# EAGLE design schematic (EAGLE 9.5.1)

## Sheet 1 of 3
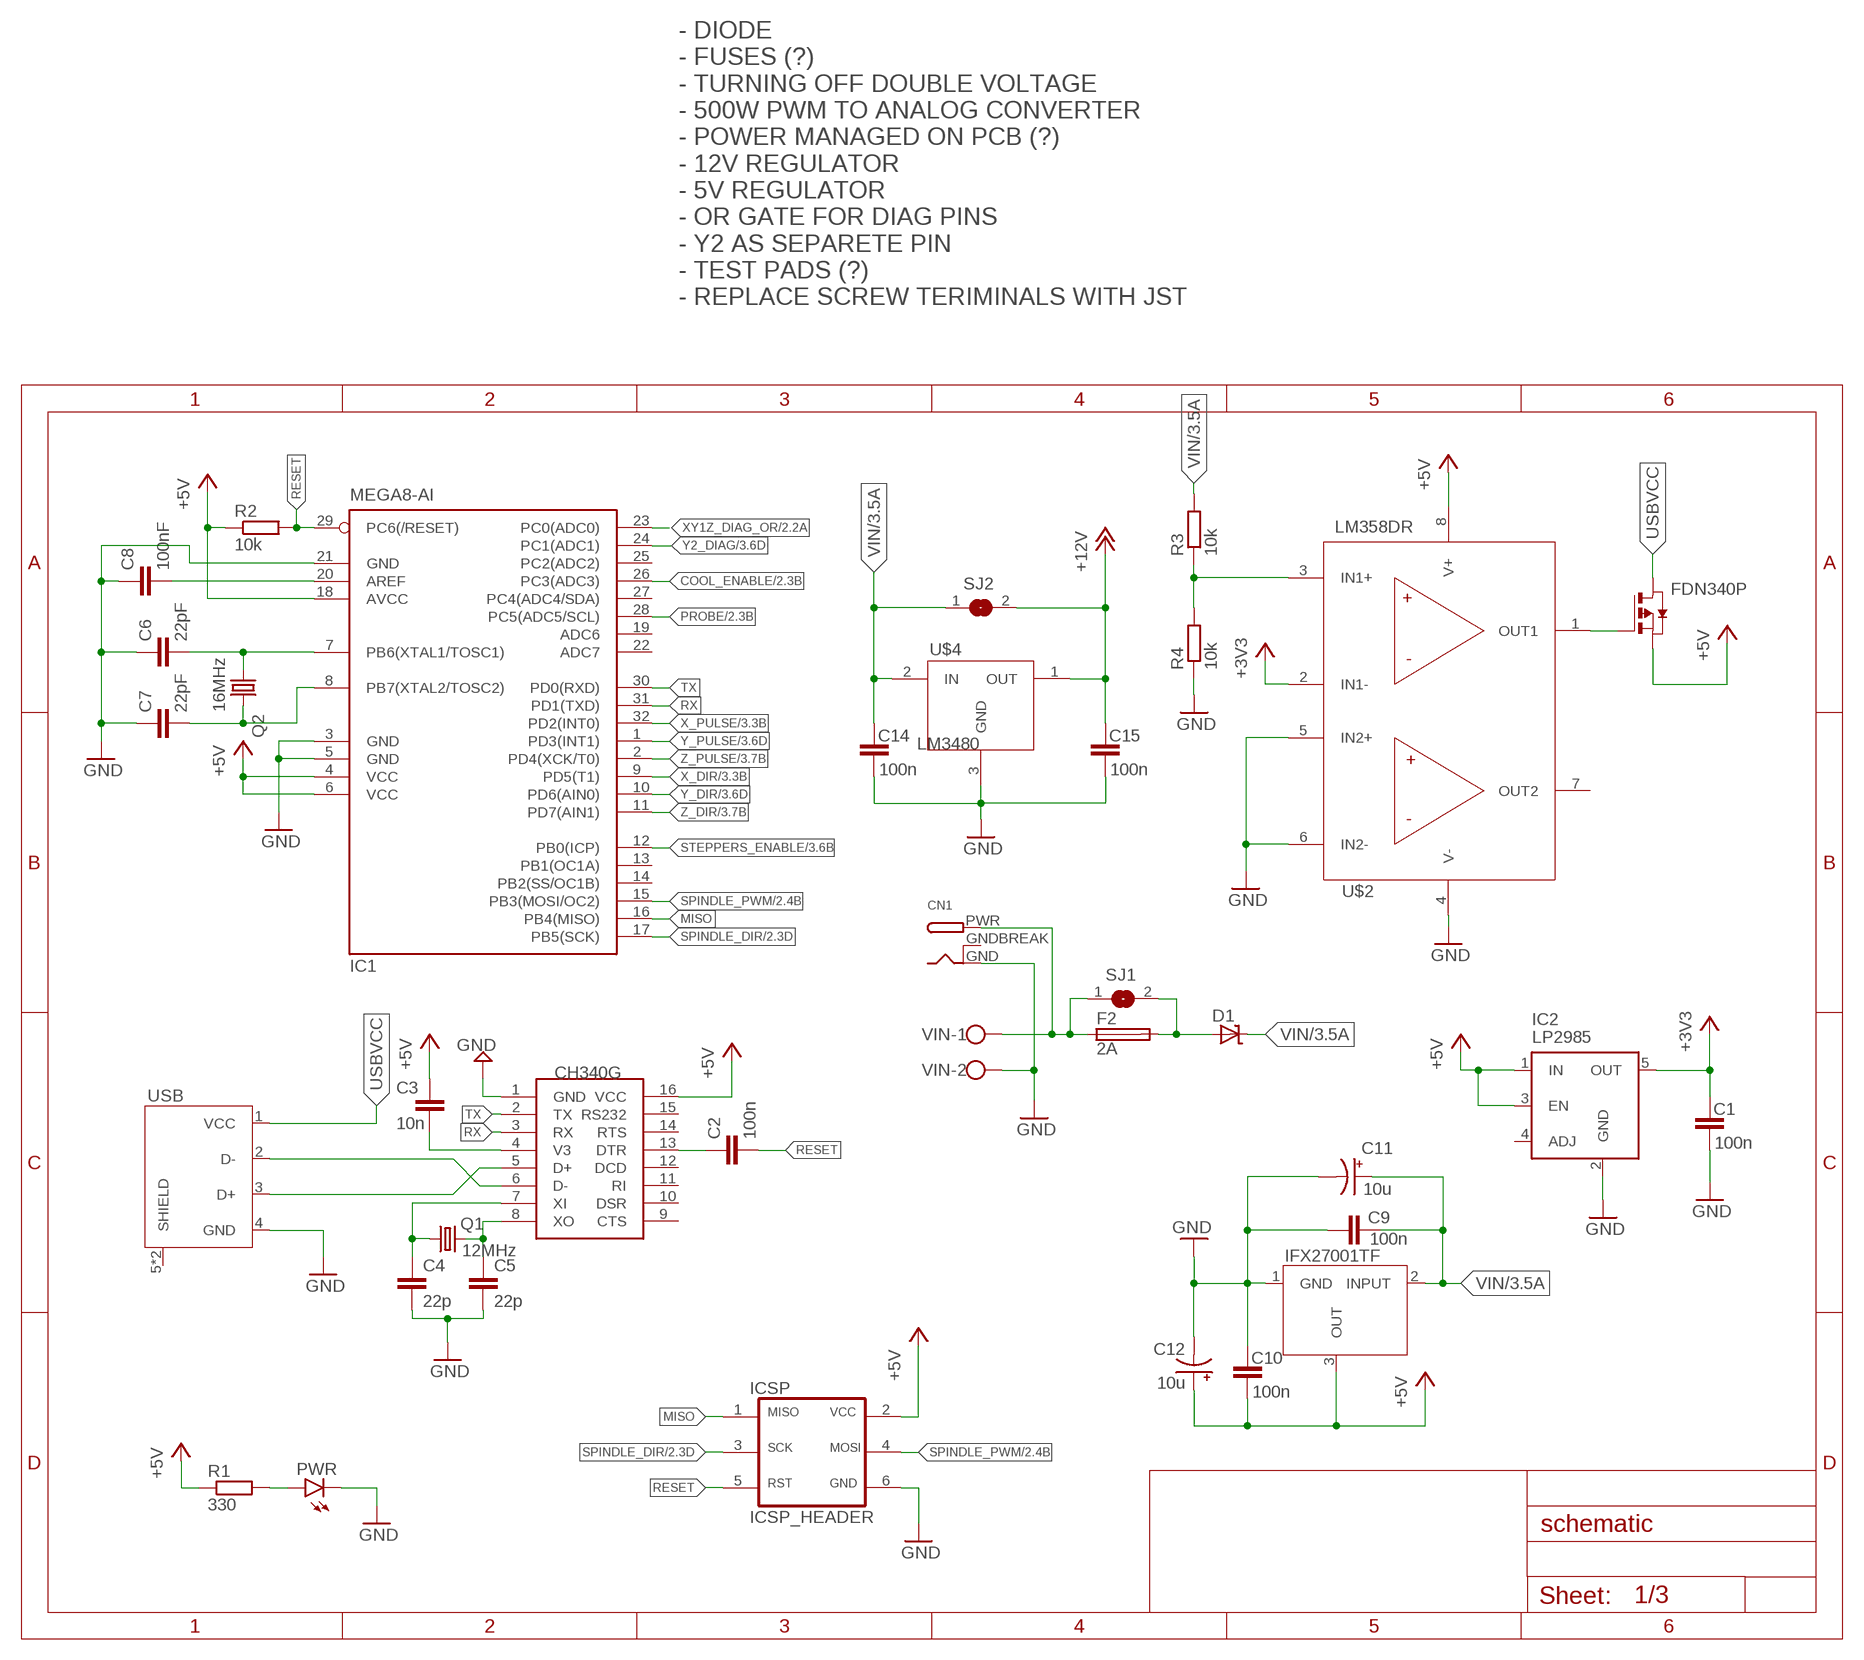
[diagram p0: schematic, sheet 1]

### Parts
C1  100n  C-EUC0603  [C0603]
C2  100n  C-EUC0603  [C0603]
C3  10n  C-EUC0603  [C0603]
C4  22p  C-EUC0603  [C0603]
C5  22p  C-EUC0603  [C0603]
C6  22pF  C-EUC0603  [C0603]
C7  22pF  C-EUC0603  [C0603]
C8  100nF  C-EUC0603  [C0603]
C9  100n  C-EUC0603  [C0603]
C10  100n  C-EUC0603  [C0603]
C11  10u  CPOL-USE5-5  [E5-5]
C12  10u  CPOL-USE5-5  [E5-5]
C14  100n  C-EUC0603  [C0603]
C15  100n  C-EUC0603  [C0603]
CN1  DCBARRELPTH  [DCJACK_2MM_PTH]
D1  SD-SMA  [SMA]
F2  2A  GSH15  [GSH15]
FDN340P  FDN340PSOT23  [SOT95P240X110-3N]
IC1  MEGA8-AI  [TQFP32-08]
IC2  LP2985  MIC5219BM5  [SOT23-5]
IFX27001TF  IFX27001TFV50TO252  [TO228P998X230-3N]
PWR  LEDCHIPLED_0805  [CHIPLED_0805]
Q1  12MHz  KX-9B  [5.0X3.2_2]
Q2  16MHz  KX-9B  [5.0X3.2_2]
R1  330  R-EU_R0603  [R0603]
R2  10k  R-EU_R0603  [R0603]
R3  10k  R-EU_R0603  [R0603]
R4  10k  R-EU_R0603  [R0603]
SJ1  SJW  [SJW]
SJ2  SJ  [SJ]
U$1  CH340G  [SOIC16]
U$2  LM358  LM358DRLM358DR_SOIC8  [SOIC127P599X175-8N]
U$4  LM3480  LM3480IM3SOT23-3  [SOT95P247X112-3N]
U$6  ICSP_HEADER  [ICSP_HEADER]
USB  U-USBBR04P-F000  [U-USBBR04P-F000]
VIN  W237-102  [W237-102]

### Nets
+3V3: C1.2 IC2.5(OUT) U$2.2(IN1-)
+5V: C3.1 C10.1 C12.+ FDN340P.2(S) IC1.4(VCC) IC1.6(VCC) IC1.18(AVCC) IC2.1(IN) IC2.3(EN) IFX27001TF.3(OUT) R1.1 R2.1 U$1.16(VCC) U$2.8(V+) U$6.2(VCC) ; also sheet 2,3
+12V: C15.2 SJ2.2 U$4.1(OUT) ; also sheet 2
COOL_ENABLE: IC1.26(PC3(ADC3)) ; also sheet 2
GND: C1.1 C4.2 C5.2 C6.1 C7.1 C8.1 C9.1 C10.2 C11.- C12.- C14.1 C15.1 CN1.GND IC1.3(GND) IC1.5(GND) IC1.21(GND) IC2.2(GND) IFX27001TF.1(GND) PWR.C R4.1 U$1.1(GND) U$2.4(V-) U$2.5(IN2+) U$2.6(IN2-) U$4.3(GND) U$6.6(GND) USB.4(GND) VIN.2 ; also sheet 2,3
MISO: IC1.16(PB4(MISO)) U$6.1(MISO)
N$1: C3.2 U$1.4(V3)
N$2: C2.1 U$1.13(DTR)
N$3: C5.1 Q1.2 U$1.8(XO)
N$4: C4.1 Q1.1 U$1.7(XI)
N$5: U$1.6(D-) USB.2(D-)
N$6: PWR.A R1.2
N$7: C6.2 IC1.7(PB6(XTAL1/TOSC1)) Q2.1
N$8: C7.2 IC1.8(PB7(XTAL2/TOSC2)) Q2.2
N$9: C8.2 IC1.20(AREF)
N$11: U$1.5(D+) USB.3(D+)
N$12: FDN340P.1(G) U$2.1(OUT1)
N$15: CN1.PWR F2.1 SJ1.1 VIN.1
N$16: R3.1 R4.2 U$2.3(IN1+)
N$17: D1.A F2.2 SJ1.2
PROBE: IC1.28(PC5(ADC5/SCL)) ; also sheet 2
RESET: C2.2 IC1.29(PC6(/RESET)) R2.2 U$6.5(RST)
RX: IC1.31(PD1(TXD)) U$1.3(RX)
SPINDLE_DIR: IC1.17(PB5(SCK)) U$6.3(SCK) ; also sheet 2
SPINDLE_PWM: IC1.15(PB3(MOSI/OC2)) U$6.4(MOSI) ; also sheet 2
STEPPERS_ENABLE: IC1.12(PB0(ICP)) ; also sheet 3
TX: IC1.30(PD0(RXD)) U$1.2(TX)
USBVCC: FDN340P.3(D) USB.1(VCC)
VIN: C9.2 C11.+ C14.2 D1.C IFX27001TF.2(INPUT) R3.2 SJ2.1 U$4.2(IN) ; also sheet 3
X_DIR: IC1.9(PD5(T1)) ; also sheet 3
X_PULSE: IC1.32(PD2(INT0)) ; also sheet 3
XY1Z_DIAG_OR: IC1.23(PC0(ADC0)) ; also sheet 2
Y2_DIAG: IC1.24(PC1(ADC1)) ; also sheet 3
Y_DIR: IC1.10(PD6(AIN0)) ; also sheet 3
Y_PULSE: IC1.1(PD3(INT1)) ; also sheet 3
Z_DIR: IC1.11(PD7(AIN1)) ; also sheet 3
Z_PULSE: IC1.2(PD4(XCK/T0)) ; also sheet 3
Unconnected: IC1.13(PB1(OC1A)) IC1.14(PB2(SS/OC1B)) IC1.19(ADC6) IC1.22(ADC7) IC1.25(PC2(ADC2)) IC1.27(PC4(ADC4/SDA)) IC2.4(ADJ) U$1.9(CTS) U$1.10(DSR) U$1.11(RI) U$1.12(DCD) U$1.14(RTS) U$1.15(RS232) U$2.7(OUT2) USB.5(SHIELD) USB.6(SHIELD)

### Notes on the sheet
- - DIODE
  - FUSES (?)
  - TURNING OFF DOUBLE VOLTAGE
  - 500W PWM TO ANALOG CONVERTER
  - POWER MANAGED ON PCB (?)
  - 12V REGULATOR
  - 5V REGULATOR
  - OR GATE FOR DIAG PINS
  - Y2 AS SEPARETE PIN
  - TEST PADS (?)
  - REPLACE SCREW TERIMINALS WITH JST

## Sheet 2 of 3
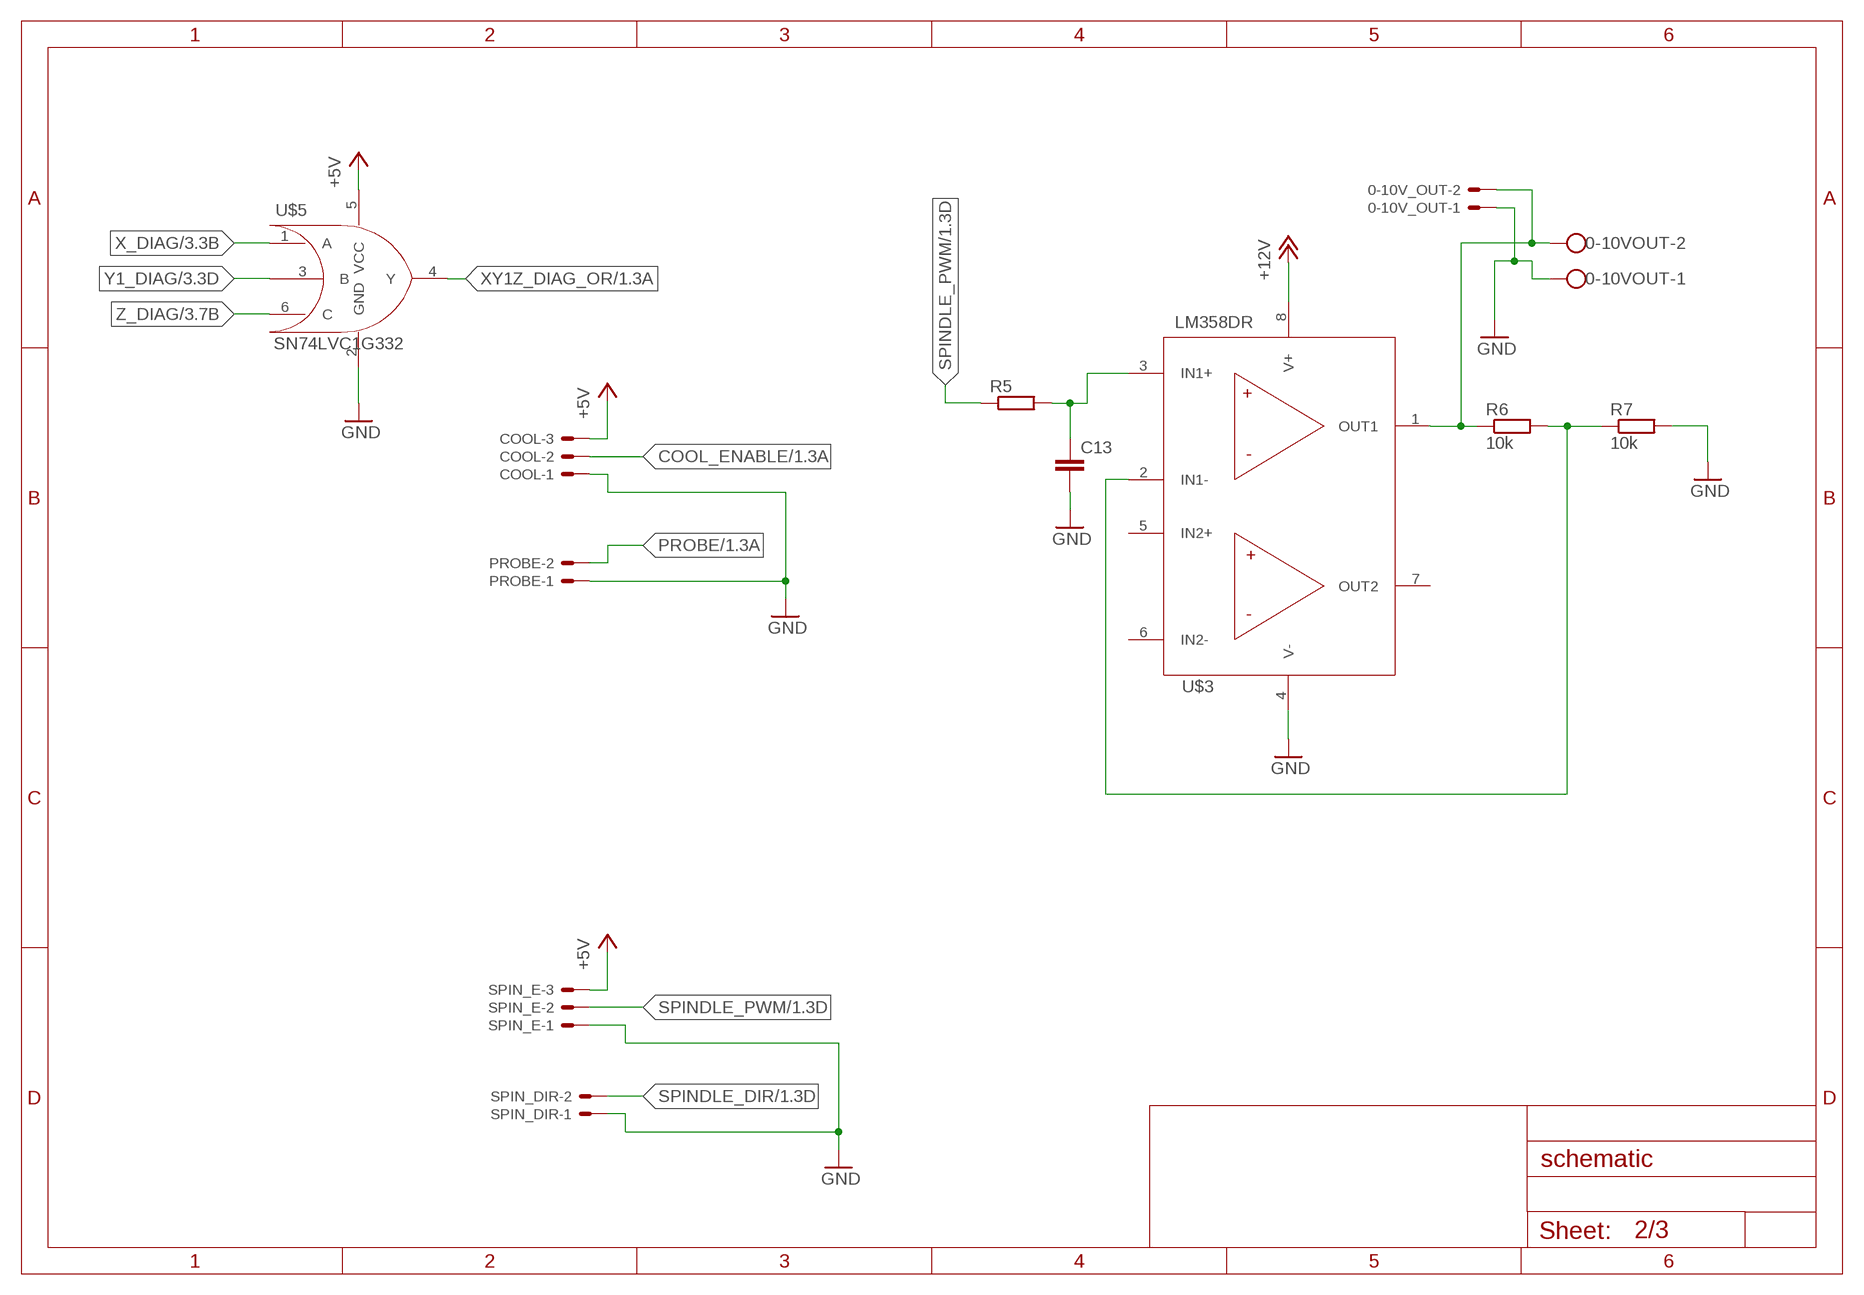
[diagram p1: schematic, sheet 2]

### Parts
0-10V_OUT  JST-XH-02-PIN-LONG-PAD  [JST-XH-02-PACKAGE-LONG-PAD]
0-10VOUT  W237-102  [W237-102]
C13  C-EUC0603  [C0603]
COOL  JST-XH-03-PIN-LONG-PAD  [JST-XH-03-PACKAGE-LONG-PAD]
PROBE  JST-XH-02-PIN-LONG-PAD  [JST-XH-02-PACKAGE-LONG-PAD]
R5  R-EU_R0603  [R0603]
R6  10k  R-EU_R0603  [R0603]
R7  10k  R-EU_R0603  [R0603]
SPIN_DIR  JST-XH-02-PIN-LONG-PAD  [JST-XH-02-PACKAGE-LONG-PAD]
SPIN_E  JST-XH-03-PIN-LONG-PAD  [JST-XH-03-PACKAGE-LONG-PAD]
U$3  LM358  LM358DRLM358DR_SOIC8  [SOIC127P599X175-8N]
U$5  SN74LVC1G332  SN74LVC1G332SOT23_SN74LVC1G332  [SOT95P280X110-6N]

### Nets
+5V: COOL.3 SPIN_E.3 U$5.5(VCC) ; also sheet 1,3
+12V: U$3.8(V+) ; also sheet 1
COOL_ENABLE: COOL.2 ; also sheet 1
GND: 0-10V_OUT.1 0-10VOUT.1 C13.2 COOL.1 PROBE.1 R7.2 SPIN_DIR.1 SPIN_E.1 U$3.4(V-) U$5.2(GND) ; also sheet 1,3
N$19: C13.1 R5.2 U$3.3(IN1+)
N$20: R6.2 R7.1 U$3.2(IN1-)
N$21: 0-10V_OUT.2 0-10VOUT.2 R6.1 U$3.1(OUT1)
PROBE: PROBE.2 ; also sheet 1
SPINDLE_DIR: SPIN_DIR.2 ; also sheet 1
SPINDLE_PWM: R5.1 SPIN_E.2 ; also sheet 1
X_DIAG: U$5.1(A) ; also sheet 3
XY1Z_DIAG_OR: U$5.4(Y) ; also sheet 1
Y1_DIAG: U$5.3(B) ; also sheet 3
Z_DIAG: U$5.6(C) ; also sheet 3
Unconnected: U$3.5(IN2+) U$3.6(IN2-) U$3.7(OUT2)

## Sheet 3 of 3
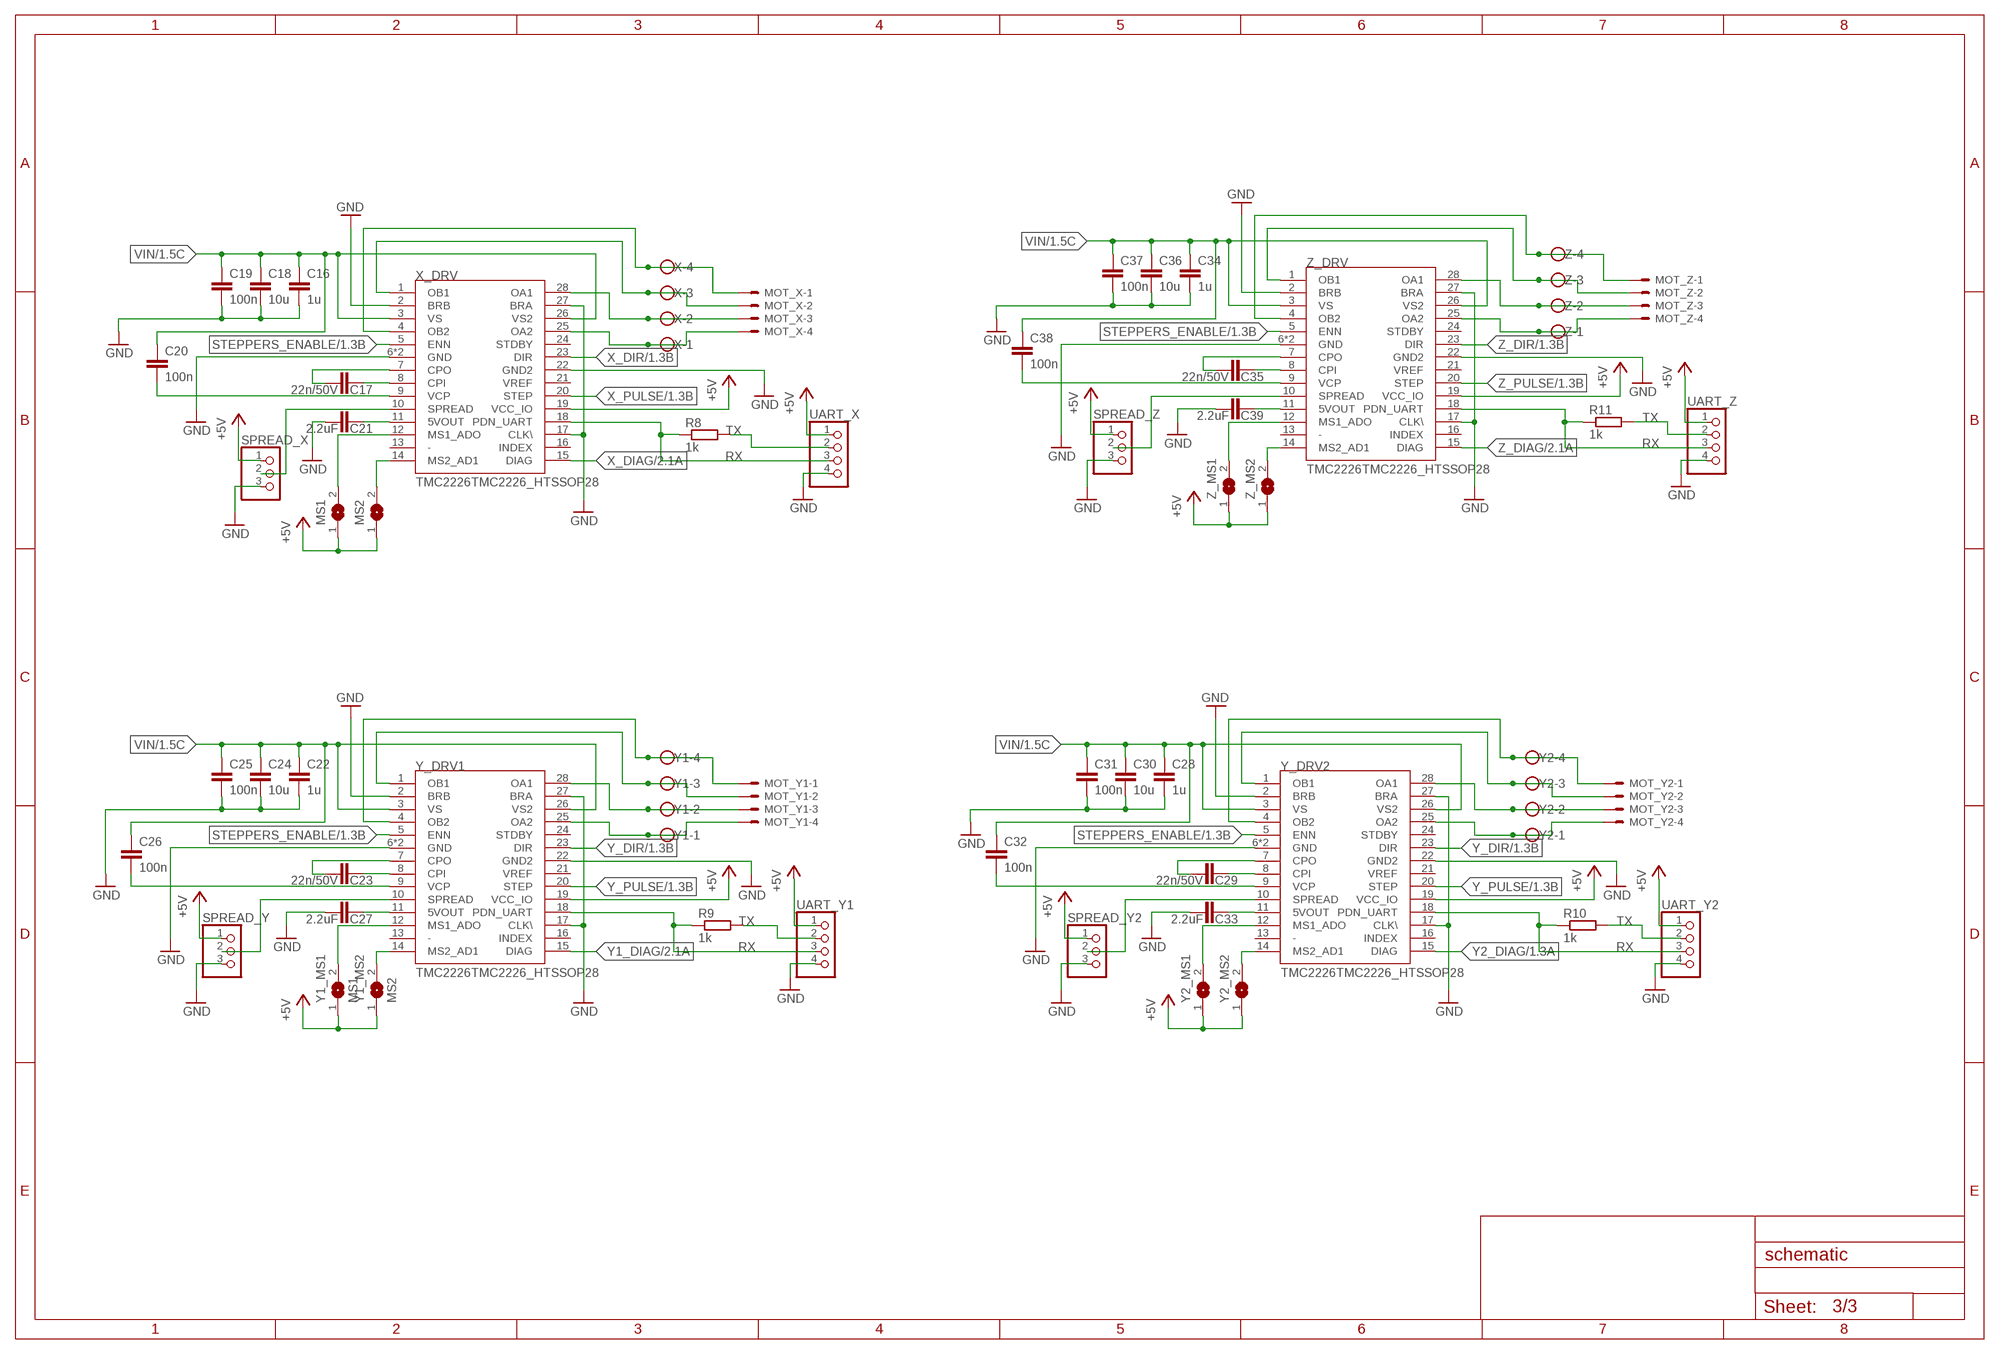
[diagram p2: schematic, sheet 3]

### Parts
C16  1u  C-EUC0603  [C0603]
C17  22n/50V  C-EUC0603  [C0603]
C18  10u  C-EUC0603  [C0603]
C19  100n  C-EUC0603  [C0603]
C20  100n  C-EUC0603  [C0603]
C21  2.2uF  C-EUC0603  [C0603]
C22  1u  C-EUC0603  [C0603]
C23  22n/50V  C-EUC0603  [C0603]
C24  10u  C-EUC0603  [C0603]
C25  100n  C-EUC0603  [C0603]
C26  100n  C-EUC0603  [C0603]
C27  2.2uF  C-EUC0603  [C0603]
C28  1u  C-EUC0603  [C0603]
C29  22n/50V  C-EUC0603  [C0603]
C30  10u  C-EUC0603  [C0603]
C31  100n  C-EUC0603  [C0603]
C32  100n  C-EUC0603  [C0603]
C33  2.2uF  C-EUC0603  [C0603]
C34  1u  C-EUC0603  [C0603]
C35  22n/50V  C-EUC0603  [C0603]
C36  10u  C-EUC0603  [C0603]
C37  100n  C-EUC0603  [C0603]
C38  100n  C-EUC0603  [C0603]
C39  2.2uF  C-EUC0603  [C0603]
MOT_X  JST-XH-04-PIN-LONG-PAD  [JST-XH-04-PACKAGE-LONG-PAD]
MOT_Y1  JST-XH-04-PIN-LONG-PAD  [JST-XH-04-PACKAGE-LONG-PAD]
MOT_Y2  JST-XH-04-PIN-LONG-PAD  [JST-XH-04-PACKAGE-LONG-PAD]
MOT_Z  JST-XH-04-PIN-LONG-PAD  [JST-XH-04-PACKAGE-LONG-PAD]
MS1  SJ  [SJ]
MS2  SJ  [SJ]
R8  1k  R-EU_R0603  [R0603]
R9  1k  R-EU_R0603  [R0603]
R10  1k  R-EU_R0603  [R0603]
R11  1k  R-EU_R0603  [R0603]
SPREAD_X  PINHD-1X3  [1X03]
SPREAD_Y  PINHD-1X3  [1X03]
SPREAD_Y2  PINHD-1X3  [1X03]
SPREAD_Z  PINHD-1X3  [1X03]
UART_X  PINHD-1X4  [1X04]
UART_Y1  PINHD-1X4  [1X04]
UART_Y2  PINHD-1X4  [1X04]
UART_Z  PINHD-1X4  [1X04]
X  W237-4  [W237-4]
X_DRV  TMC2226TMC2226_HTSSOP28  [SOP65P640X120-29T275X620N]
Y1  W237-4  [W237-4]
Y1_MS1  MS1  SJ  [SJ]
Y1_MS2  MS2  SJ  [SJ]
Y2  W237-4  [W237-4]
Y2_MS1  SJ  [SJ]
Y2_MS2  SJ  [SJ]
Y_DRV1  TMC2226TMC2226_HTSSOP28  [SOP65P640X120-29T275X620N]
Y_DRV2  TMC2226TMC2226_HTSSOP28  [SOP65P640X120-29T275X620N]
Z  W237-4  [W237-4]
Z_DRV  TMC2226TMC2226_HTSSOP28  [SOP65P640X120-29T275X620N]
Z_MS1  SJ  [SJ]
Z_MS2  SJ  [SJ]

### Nets
+5V: MS1.1 MS2.1 SPREAD_X.1 SPREAD_Y2.1 SPREAD_Y.1 SPREAD_Z.1 UART_X.1 UART_Y1.1 UART_Y2.1 UART_Z.1 X_DRV.19(VCC_IO) Y1_MS1.1 Y1_MS2.1 Y2_MS1.1 Y2_MS2.1 Y_DRV1.19(VCC_IO) Y_DRV2.19(VCC_IO) Z_DRV.19(VCC_IO) Z_MS1.1 Z_MS2.1 ; also sheet 1,2
GND: C16.2 C18.2 C19.2 C21.1 C22.2 C24.2 C25.2 C27.1 C28.2 C30.2 C31.2 C33.1 C34.2 C36.2 C37.2 C39.1 SPREAD_X.3 SPREAD_Y2.3 SPREAD_Y.3 SPREAD_Z.3 UART_X.4 UART_Y1.4 UART_Y2.4 UART_Z.4 X_DRV.2(BRB) X_DRV.6(GND) X_DRV.17(CLK\) X_DRV.22(GND2) X_DRV.27(BRA) X_DRV.29(GND) Y_DRV1.2(BRB) Y_DRV1.6(GND) Y_DRV1.17(CLK\) Y_DRV1.22(GND2) Y_DRV1.27(BRA) Y_DRV1.29(GND) Y_DRV2.2(BRB) Y_DRV2.6(GND) Y_DRV2.17(CLK\) Y_DRV2.22(GND2) Y_DRV2.27(BRA) Y_DRV2.29(GND) Z_DRV.2(BRB) Z_DRV.6(GND) Z_DRV.17(CLK\) Z_DRV.22(GND2) Z_DRV.27(BRA) Z_DRV.29(GND) ; also sheet 1,2
N$18: C17.2 X_DRV.8(CPI)
N$22: C17.1 X_DRV.7(CPO)
N$23: MOT_X.1 X.4 X_DRV.4(OB2)
N$24: MOT_X.2 X.3 X_DRV.1(OB1)
N$25: MOT_X.3 X.2 X_DRV.28(OA1)
N$26: MOT_X.4 X.1 X_DRV.25(OA2)
N$27: SPREAD_X.2 X_DRV.10(SPREAD)
N$28: C20.2 X_DRV.9(VCP)
N$29: C21.2 X_DRV.11(5VOUT)
N$30: R8.1 UART_X.3 X_DRV.18(PDN_UART)
N$31: MS1.2 X_DRV.12(MS1_ADO)
N$32: MS2.2 X_DRV.14(MS2_AD1)
N$33: R8.2 UART_X.2
N$34: C23.2 Y_DRV1.8(CPI)
N$35: C23.1 Y_DRV1.7(CPO)
N$36: MOT_Y1.1 Y1.4 Y_DRV1.4(OB2)
N$37: MOT_Y1.2 Y1.3 Y_DRV1.1(OB1)
N$38: MOT_Y1.3 Y1.2 Y_DRV1.28(OA1)
N$39: MOT_Y1.4 Y1.1 Y_DRV1.25(OA2)
N$40: C26.2 Y_DRV1.9(VCP)
N$41: SPREAD_Y.2 Y_DRV1.10(SPREAD)
N$42: C27.2 Y_DRV1.11(5VOUT)
N$43: Y1_MS1.2 Y_DRV1.12(MS1_ADO)
N$44: Y1_MS2.2 Y_DRV1.14(MS2_AD1)
N$45: R9.1 UART_Y1.3 Y_DRV1.18(PDN_UART)
N$46: R9.2 UART_Y1.2
N$47: C29.2 Y_DRV2.8(CPI)
N$48: C29.1 Y_DRV2.7(CPO)
N$49: MOT_Y2.1 Y2.4 Y_DRV2.4(OB2)
N$50: MOT_Y2.2 Y2.3 Y_DRV2.1(OB1)
N$51: MOT_Y2.3 Y2.2 Y_DRV2.28(OA1)
N$52: MOT_Y2.4 Y2.1 Y_DRV2.25(OA2)
N$53: C32.2 Y_DRV2.9(VCP)
N$54: SPREAD_Y2.2 Y_DRV2.10(SPREAD)
N$55: C33.2 Y_DRV2.11(5VOUT)
N$56: Y2_MS1.2 Y_DRV2.12(MS1_ADO)
N$57: Y2_MS2.2 Y_DRV2.14(MS2_AD1)
N$58: R10.1 UART_Y2.3 Y_DRV2.18(PDN_UART)
N$59: R10.2 UART_Y2.2
N$60: C35.2 Z_DRV.8(CPI)
N$61: C35.1 Z_DRV.7(CPO)
N$62: MOT_Z.1 Z.4 Z_DRV.4(OB2)
N$63: MOT_Z.2 Z.3 Z_DRV.1(OB1)
N$64: MOT_Z.3 Z.2 Z_DRV.28(OA1)
N$65: MOT_Z.4 Z.1 Z_DRV.25(OA2)
N$66: C38.2 Z_DRV.9(VCP)
N$67: SPREAD_Z.2 Z_DRV.10(SPREAD)
N$68: C39.2 Z_DRV.11(5VOUT)
N$69: Z_DRV.12(MS1_ADO) Z_MS1.2
N$70: Z_DRV.14(MS2_AD1) Z_MS2.2
N$71: R11.1 UART_Z.3 Z_DRV.18(PDN_UART)
N$72: R11.2 UART_Z.2
STEPPERS_ENABLE: X_DRV.5(ENN) Y_DRV1.5(ENN) Y_DRV2.5(ENN) Z_DRV.5(ENN) ; also sheet 1
VIN: C16.1 C18.1 C19.1 C20.1 C22.1 C24.1 C25.1 C26.1 C28.1 C30.1 C31.1 C32.1 C34.1 C36.1 C37.1 C38.1 X_DRV.3(VS) X_DRV.26(VS2) Y_DRV1.3(VS) Y_DRV1.26(VS2) Y_DRV2.3(VS) Y_DRV2.26(VS2) Z_DRV.3(VS) Z_DRV.26(VS2) ; also sheet 1
X_DIAG: X_DRV.15(DIAG) ; also sheet 2
X_DIR: X_DRV.23(DIR) ; also sheet 1
X_PULSE: X_DRV.20(STEP) ; also sheet 1
Y1_DIAG: Y_DRV1.15(DIAG) ; also sheet 2
Y2_DIAG: Y_DRV2.15(DIAG) ; also sheet 1
Y_DIR: Y_DRV1.23(DIR) Y_DRV2.23(DIR) ; also sheet 1
Y_PULSE: Y_DRV1.20(STEP) Y_DRV2.20(STEP) ; also sheet 1
Z_DIAG: Z_DRV.15(DIAG) ; also sheet 2
Z_DIR: Z_DRV.23(DIR) ; also sheet 1
Z_PULSE: Z_DRV.20(STEP) ; also sheet 1
Unconnected: X_DRV.13(-) X_DRV.16(INDEX) X_DRV.21(VREF) X_DRV.24(STDBY) Y_DRV1.13(-) Y_DRV1.16(INDEX) Y_DRV1.21(VREF) Y_DRV1.24(STDBY) Y_DRV2.13(-) Y_DRV2.16(INDEX) Y_DRV2.21(VREF) Y_DRV2.24(STDBY) Z_DRV.13(-) Z_DRV.16(INDEX) Z_DRV.21(VREF) Z_DRV.24(STDBY)

### Notes on the sheet
- TX
- TX
- RX
- RX
- TX | TX
- RX | RX

## Power pins joined to a net without a drawn wire
GNDBREAK: CN1.GNDBREAK

## Library data of the parts
0-10V_OUT PROBE SPIN_DIR = Rembrandt Electronics - JST XH Connectors v1-0:JST-XH-02-PIN: JST XH Connector 2 Pin Wire to board connector. Pitch: 2,54 mm, (0.100") Number of pins: 2 Created by Rembrandt Electronics www.rembrandtelectronics.com
0-10VOUT VIN = con-wago-500:W237-102: WAGO SCREW CLAMP; MPN: 237-102; OC_FARNELL: unknown; OC_NEWARK: 70K9898
C1-C10 C13-C39 = rcl:C-EU: CAPACITOR, European symbol; SPICEPREFIX: C
C11 C12 = rcl:CPOL-US: POLARIZED CAPACITOR, American symbol; SPICEPREFIX: C
CN1 = adafruit:DCBARREL: 2.0mm DC Barrel Jack DCJACK_2MM_PTH - Through Hole Jack (4UConnector: 05537)
COOL SPIN_E = Rembrandt Electronics - JST XH Connectors v1-0:JST-XH-03-PIN: JST XH Connector 2 Pin Wire to board connector. Pitch: 2,54 mm, (0.100") Number of pins: 3 Created by Rembrandt Electronics www.rembrandtelectronics.com
D1 = diodes:SD-: Schottky diode
F2 = fuse:GSH15: FUSE HOLDER grid 15mm, 19649 Wickmann; MPN: 64900001039; OC_FARNELL: 1271673; OC_NEWARK: 02P0318
FDN340P = NikodemBartnik:FDN340P
IC1 = atmel:MEGA8: MICROCONTROLLER 8 Kbytes FLASH, 1 kbytes SRAM, 512 bytes EEPROM, USART, 6-channel 10 bit ADC, 2-channel 8 bit ADC Pin compatible with Atmega48, ATMega88, ATMega168 Source: avr.lbr; MPN: ATMEGA8-16AU; OC_FARNELL: 9171371; OC_NEWARK: 73M8863
IC2 = v-reg-micrel:MIC5219BM5: VOLTAGE REGULATOR; MF: ALTERA CORPORATION; MPN: MIC5219BM5 TR; OC_FARNELL: 1100656; OC_NEWARK: 09J8939
IFX27001TF = NikodemBartnik:IFX27001TFV50
MOT_X MOT_Y1 MOT_Y2 MOT_Z = Rembrandt Electronics - JST XH Connectors v1-0:JST-XH-04-PIN: JST XH Connector 2 Pin Wire to board connector. Pitch: 2,54 mm, (0.100") Number of pins: 4 Created by Rembrandt Electronics www.rembrandtelectronics.com
MS1 MS2 SJ1 SJ2 Y1_MS1 Y1_MS2 Y2_MS1 Y2_MS2 Z_MS1 Z_MS2 = jumper:SJ: SMD solder JUMPER
PWR = led:LED: LED OSRAM: - CHIPLED LG R971, LG N971, LY N971, LG Q971, LY Q971, LO R971, LY R971 LH N974, LH R974 LS Q976, LO Q976, LY Q976 LO Q996 - Hyper CHIPLED LW Q18S LB Q993, LB Q99A, LB R99A - SideLED LS A670, LO A670, LY A670, LG A670, LP A670 LB A673, LV A673, LT A673, LW A673 LH A674 LY A675 LS A676, LA A676, LO A676, LY A676, LW A676 LS A679, LY A679, LG A679 - Hyper Micro SIDELED® LS Y876, LA Y876, LO Y876, LY Y876 LT Y87S - SmartLED LW L88C, LW L88S LB L89C, LB L89S, LG L890 LS L89K, LO L89K, LY L89K LS L896, LA L896, LO L896, LY L896 - TOPLED LS T670, LO T670, LY T670, LG T670, LP T670 LSG T670, LSP T670, LSY T670, LOP T670, LYG T670 LG T671, LOG T671, LSG T671 LB T673, LV T673, LT T673, LW T673 LH T674 LS T676, LA T676, LO T676, LY T676, LB T676, LH T676, LSB T676, LW T676 LB T67C, LV T67C, LT T67C, LS T67K, LO T67K, LY T67K, LW E67C LS E67B, LA E67B, LO E67B, LY E67B, LB E67C, LV E67C, LT E67C LW T67C LS T679, LY T679, LG T679 LS T770, LO T770, LY T770, LG T770, LP T770 LB T773, LV T773, LT T773, LW T773 LH T774 LS E675, LA E675, LY E675, LS T675 LS T776, LA T776, LO T776, LY T776, LB T776 LHGB T686 LT T68C, LB T68C - Hyper Mini TOPLED® LB M676 - Mini TOPLED Santana® LG M470 LS M47K, LO M47K, LY M47K Source: http://www.osram.convergy.de LUXEON: - LUMILED® LXK2-PW12-R00, LXK2-PW12-S00, LXK2-PW14-U00, LXK2-PW14-V00 LXK2-PM12-R00, LXK2-PM12-S00, LXK2-PM14-U00 LXK2-PE12-Q00, LXK2-PE12-R00, LXK2-PE12-S00, LXK2-PE14-T00, LXK2-PE14-U00 LXK2-PB12-K00, LXK2-PB12-L00, LXK2-PB12-M00, LXK2-PB14-N00, LXK2-PB14-P00, LXK2-PB14-Q00 LXK2-PR12-L00, LXK2-PR12-M00, LXK2-PR14-Q00, LXK2-PR14-R00 LXK2-PD12-Q00, LXK2-PD12-R00, LXK2-PD12-S00 LXK2-PH12-R00, LXK2-PH12-S00 LXK2-PL12-P00, LXK2-PL12-Q00, LXK2-PL12-R00 Source: www.luxeon.com KINGBRIGHT: KA-3528ASYC Source: www.kingbright.com
Q1 Q2 = crystal-geyer_V1_0:KX: Quartz Crystals (MHz) SMD: KX - Serie Model Size l/w/h [mm] Frequency Range Frequency Stability Temp. Range [°C] Load Capacitance AECQ 200 availabel Datasheet KX-4 KX-5 KX-6 KX-7 KX-9A KX-9B KX-12A KX-12B KX-13 KX-20 KX-K KX-KS 1.6/1.2/0.3 2.0/1.6/0.45 2.5/2.0/0.55 3.2/2.5/0.8 5.0/3.2/1.0 5.0/3.2/1.1 6.0/3.5/1.1 6.0/3.5/1.0 7.0/5.0 /1.3 11.6/5.5/1.6 12.3/4.5/4.2 12.3/4.5/3.2 24.0 ~ 80.0 MHz 16.0 ~ 80.0 MHz 12.0 ~ 80.0 MHz 8.0 ~ 60.0 MHz 7,68 ~ 300,0 MHz 8,0 ~ 50,0 MHz 8,0 ~ 150,0 MHz 8,0 ~ 50,0 MHz 6,0 ~ 160,0 MHz 3,579 ~ 25,0 MHz 3,579 ~ 70,0 MHz 3,579 ~ 70,0 MHz ±10 … ±50ppm ±10 … ±50ppm ±10 … ±50ppm ±10 … ±50ppm ±10 … ±50ppm ±10 … ±50ppm ±10 … ±50ppm ±10 … ±50ppm ±10 … ±50ppm ±50ppm ±10 … ±50ppm ±10 … ±50ppm (*) -40°C …+85°C (*) -40°C …+125°C (*) -40°C …+125°C (*) -40°C …+125°C (*) -40°C …+105°C (*) -40°C …+105°C (*) -40°C …+125°C (*) -40°C …+105°C (*) -40°C …+105°C (*) -40°C …+105°C (*) -40°C …+85°C (*) -40°C …+85°C 8, 8…16 8, 8…16 10, 8…16 12, 7…20 16, 10…20 16, 10…20 16, 10…20 16, 12…20 16, 12…20 16, 12…20 16, 12…30 16, 12…30 - yes yes yes - - - - - - - - KX-4.pdf <http://www.geyer-electronic.de/uploads/tx_userartikelfrequenz/GEYER-KX-4.pdf> KX-5.pdf <http://www.geyer-electronic.de/uploads/tx_userartikelfrequenz/GEYER-KX-5.pdf> KX-6.pdf <http://www.geyer-electronic.de/uploads/tx_userartikelfrequenz/GEYER-KX-6.pdf> KX-7.pdf <http://www.geyer-electronic.de/uploads/tx_userartikelfrequenz/GEYER-KX-7.pdf> KX-9A.pdf <http://www.geyer-electronic.de/uploads/tx_userartikelfrequenz/GEYER-KX-9A.pdf> KX-9B.pdf <http://www.geyer-electronic.de/uploads/tx_userartikelfrequenz/GEYER-KX-9B.pdf> KX-12A.pdf <http://www.geyer-electronic.de/uploads/tx_userartikelfrequenz/GEYER-KX-12A.pdf> KX-12B.pdf <http://www.geyer-electronic.de/uploads/tx_userartikelfrequenz/GEYER-KX-12B.pdf> KX-13.pdf <http://www.geyer-electronic.de/uploads/tx_userartikelfrequenz/GEYER-KX-13.pdf> KX-20.pdf <http://www.geyer-electronic.de/uploads/tx_userartikelfrequenz/GEYER-KX-20.pdf> KX-K.pdf <http://www.geyer-electronic.de/uploads/tx_userartikelfrequenz/GEYER-KX-K.pdf> KX-KS.pdf <http://www.geyer-electronic.de/uploads/tx_userartikelfrequenz/GEYER-KX-KS.pdf> <http://www.geyer-electronic.de/fileadmin/template/img/logo-geyer-electronic.png> Details see: http://www.geyer-electronic.de/Frequenz-Produkte.9.0.html Created 2016-06-07, Hans Locher 2016 (C) Geyer Quartz Technology KX4,KX5,KX6,KX7,KX9A,KX9B,KX12A,KX12B,KX13,KX20,KXK,KXKS;1612;2016;2520;3225;5032;6035;7050;11655;12345;1,6x1,2;2,0x1,6;2,5x2,0;3,2x2,5;5,0x3,2;6,0x3,5;7,0x5,0;11,6x5,5;12,3x4,5;12,3x4,5;1.6x1.2;2.0x1.6;2.5x2.0;3.2x2.5;5.0x3.2;6.0x3.5;7.0x5.0;11.6x5.5;12.3x4.5;12.3x4.5;
R1-R11 = rcl:R-EU_: RESISTOR, European symbol; SPICEPREFIX: R
SPREAD_X SPREAD_Y SPREAD_Y2 SPREAD_Z = pinhead:PINHD-1X3: PIN HEADER
U$1 = ch340g:CH340G
U$2 U$3 = NikodemBartnik:LM358DR: Operational Amplifiers - Op Amps Dual Op Amp 2 channel min 3V max 32V 30mA per channel
U$4 = NikodemBartnik:LM3480IM3
U$5 = NikodemBartnik:SN74LVC1G332: 3 input or gate by Texas Instruments SN74LVC1G332DBVR 74LVC 10μA 1.65V ~ 5.5V 1 ORGate 3 SOT-23-6 Gates ROHS
U$6 = NikodemBartnik:ICSP_HEADER
UART_X UART_Y1 UART_Y2 UART_Z = pinhead:PINHD-1X4: PIN HEADER
USB = NikodemBartnik:U-USBBR04P-F000: USB - Type B, Through Hole, Right Angle, USB 2.0, LCSC Part: C189733 Mfr. Part: U-USBBR04P-F000 Manufacturer: Ckmtw(Shenzhen Cankemeng)
X Y1 Y2 Z = con-wago-500:W237-4: WAGO SCREW CLAMP; OC_FARNELL: unknown; OC_NEWARK: unknown
X_DRV Y_DRV1 Y_DRV2 Z_DRV = NikodemBartnik:TMC2226: Step/Dir Drivers for Two-Phase Bipolar Stepper Motors up to 2.8A peak – StealthChop™ for Quiet Movement – UART Interface Option – Sensorless Stall Detection StallGuard4

## Net classes
0 default: clearance 0.205 mm

## Board
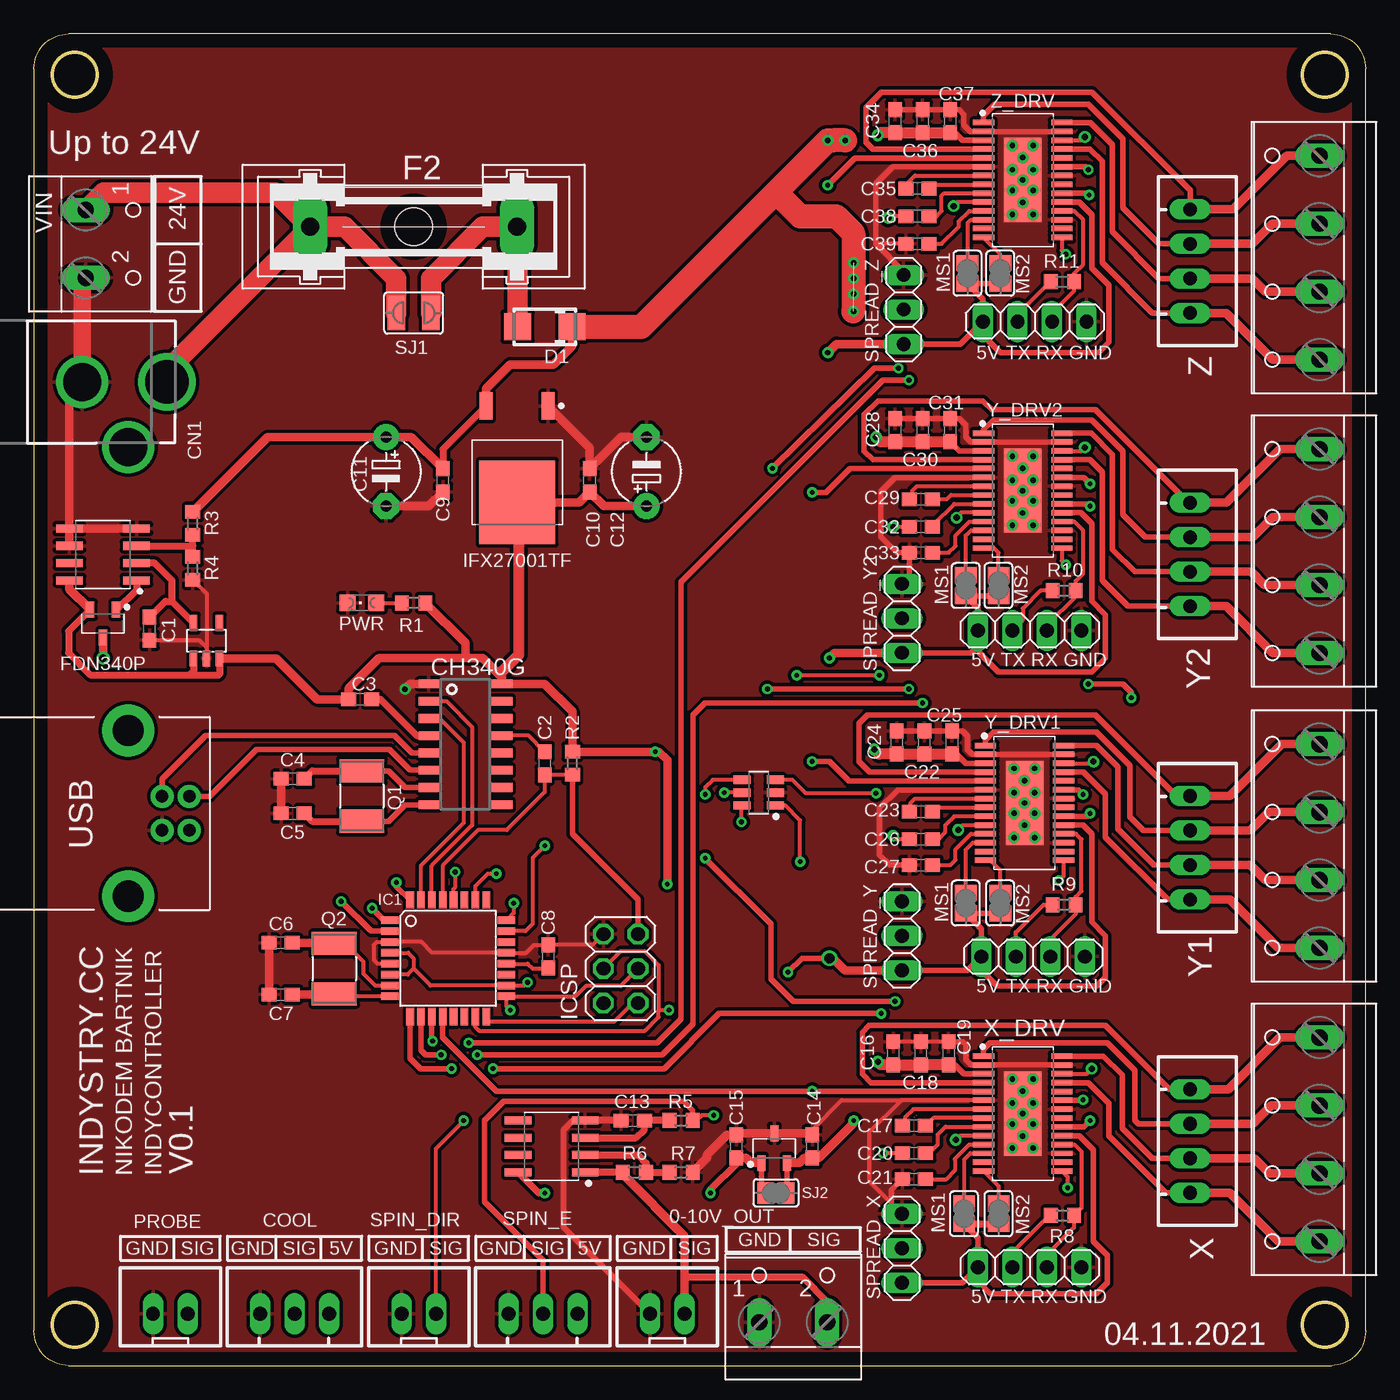
[diagram p3: board, top side]
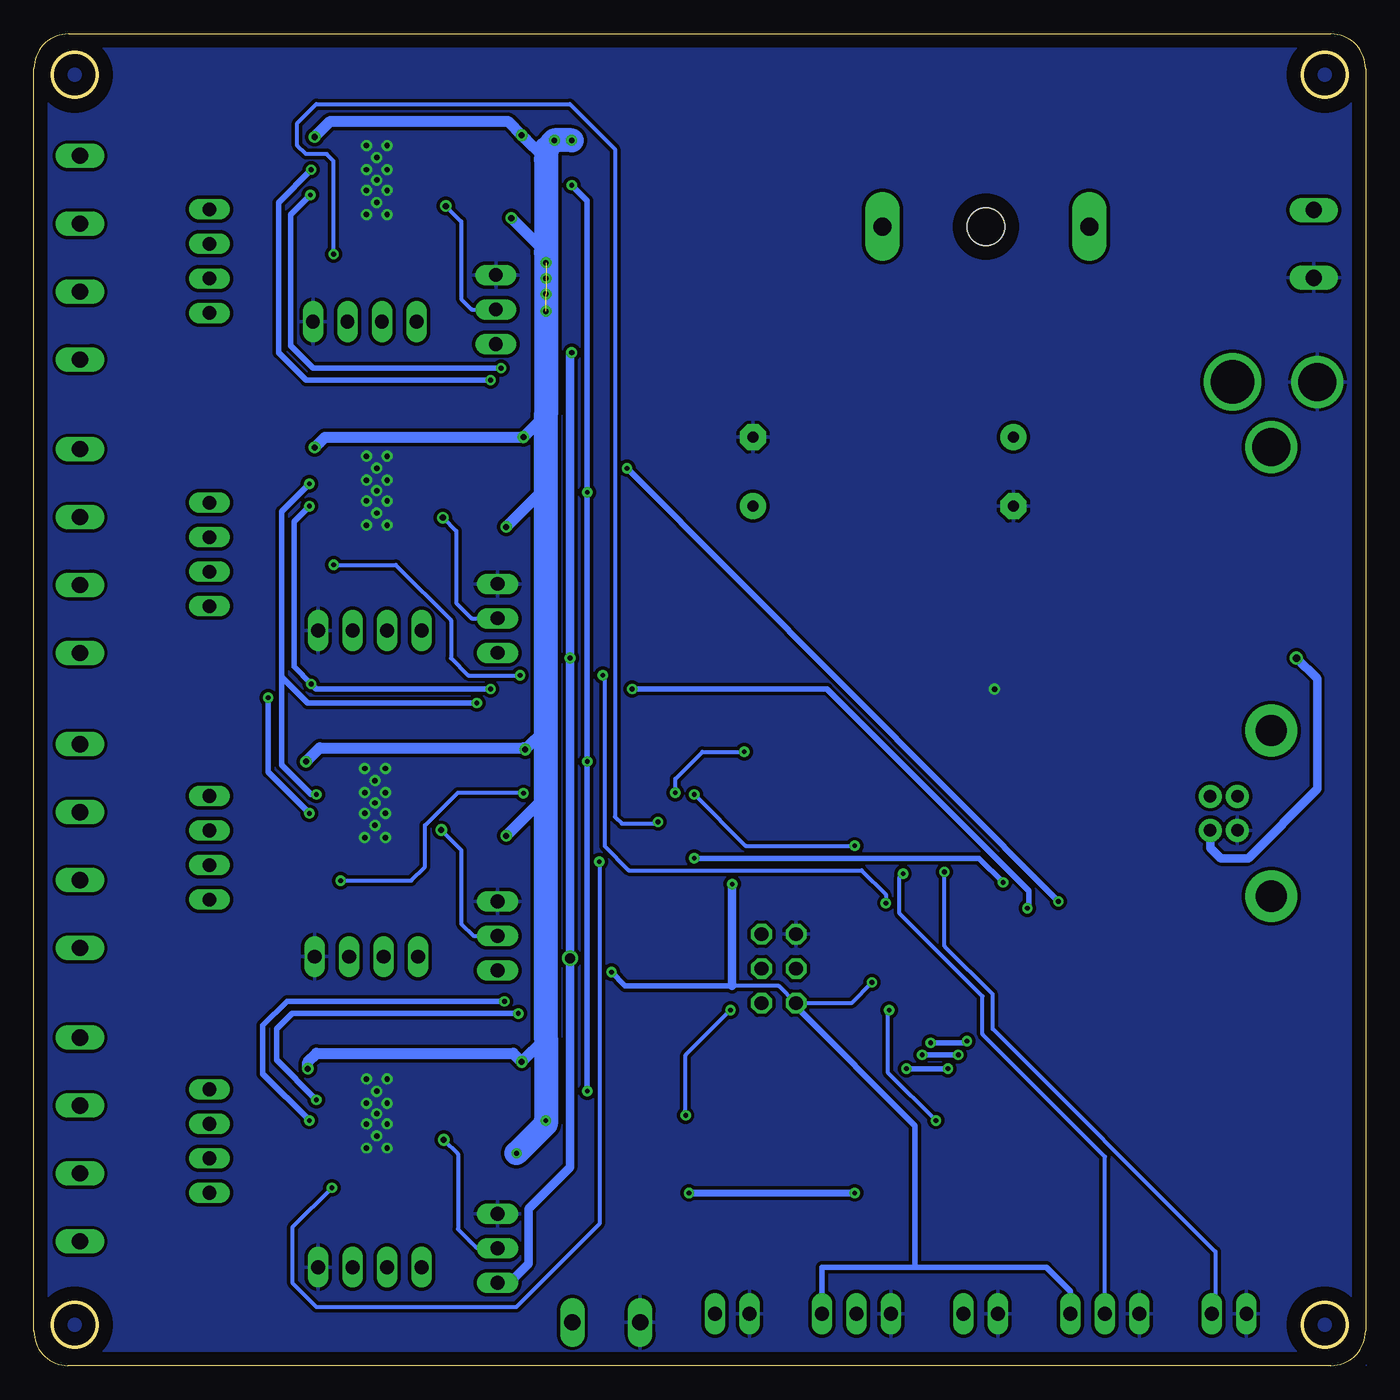
[diagram p4: board, bottom side, seen from below]

Size 98 x 98 mm. Coordinates in mm from the lower left corner, seen from the top.
Outline: 2.54,0 95.5,0 arc90 98,2.54 98,95.46 arc90 95.46,98 2.54,98 arc90 0,95.46 0,2.54 arc90 2.54,0
Outline: circle at 95,3 radius 1.65
Outline: circle at 95,95 radius 1.65
Outline: circle at 3,3 radius 1.65
Outline: circle at 3,95 radius 1.65
Copper layers (1*16): Top 0.035mm / dielectric 1.5mm / Bottom 0.035mm
Design rules "default": minimum track width 6mil, minimum drill 0.35mm, track to track 6mil, track to pad 6mil, pad to pad 6mil, via to via 6mil, smd to smd 6mil, copper to edge 40mil, drill to drill 6mil, minimum pad ring 10mil, minimum via ring 8mil, stop-mask expansion 4mil, vias tented up to drill 0mil, thermal gap 10mil

### Footprints (pad centres in the part's own frame; a part is rotated, then mirrored left to right if it is on the bottom)
JST-XH-02-PACKAGE-LONG-PAD = drill 1.016 long: 1 -1.27,0; 2 1.27,0
W237-102 = drill 1.194 long: 1 -2.5,-1.27; 2 2.5,-1.27
C0603 = smd 1.1 x 1: 1 -0.85,0; 2 0.85,0
E5-5 = drill 0.813 pad 1.905: + -2.54,0 | drill 0.813 pad 1.905 octagon: - 2.54,0
DCJACK_2MM_PTH = drill 2.8: GND 0,7.35; GNDBREAK 4.8,10.75 | drill 3.2: PWR 0,13.6
JST-XH-03-PACKAGE-LONG-PAD = drill 1.016 long: 1 -2.54,0; 2 0,0; 3 2.54,0
SMA = smd 2 x 2: A 2,0; C -2,0
GSH15 = drill 1.321 pad 2.54 long: 1 -7.62,0; 2 7.62,0 | hole 2.794: 0,0
SOT95P240X110-3N = smd 1.18 x 0.609: 1 -1.024,0.95; 2 -1.024,-0.95; 3 1.024,0
TQFP32-08 = smd 1.27 x 0.559: 1 -4.293,2.8; 2 -4.293,2; 3 -4.293,1.2; 4 -4.293,0.4; 5 -4.293,-0.4; 6 -4.293,-1.2; 7 -4.293,-2; 8 -4.293,-2.8; 17 4.293,-2.8; 18 4.293,-2; 19 4.293,-1.2; 20 4.293,-0.4; 21 4.293,0.4; 22 4.293,1.2; 23 4.293,2; 24 4.293,2.8 | smd 0.559 x 1.27: 9 -2.8,-4.293; 10 -2,-4.293; 11 -1.2,-4.293; 12 -0.4,-4.293; 13 0.4,-4.293; 14 1.2,-4.293; 15 2,-4.293; 16 2.8,-4.293; 25 2.8,4.293; 26 2,4.293; 27 1.2,4.293; 28 0.4,4.293; 29 -0.4,4.293; 30 -1.2,4.293; 31 -2,4.293; 32 -2.8,4.293
SOT23-5 = smd 0.55 x 1.2: 1 -0.95,-1.3; 2 0,-1.3; 3 0.95,-1.3; 4 0.95,1.3; 5 -0.95,1.3
TO228P998X230-3N = smd 2.015 x 0.939: 1 -4.586,2.28; 2 -4.586,-2.28 | smd 6.157 x 5.589: 3 2.515,0
JST-XH-04-PACKAGE-LONG-PAD = drill 1.016 long: 1 -3.81,0; 2 -1.27,0; 3 1.27,0; 4 3.81,0
SJ = smd 1.168 x 1.6: 1 -0.762,0; 2 0.762,0
CHIPLED_0805 = smd 1.2 x 1.2: A 0,-1.05; C 0,1.05
5.0X3.2_2 = smd 1.7 x 3.3: 1 -1.85,0; 2 1.85,0
R0603 = smd 1 x 1.1: 1 -0.85,0; 2 0.85,0
SJW = smd 1.27 x 2.54: 1 -1.27,0; 2 1.27,0
1X03 = drill 1.016 long: 1 -2.54,0; 2 0,0; 3 2.54,0
SOIC16 = smd 0.635 x 1.524: 1 -4.445,-2.695; 2 -3.175,-2.695; 3 -1.905,-2.695; 4 -0.635,-2.695; 5 0.635,-2.695; 6 1.905,-2.695; 7 3.175,-2.695; 8 4.445,-2.695; 9 4.445,2.695; 10 3.175,2.695; 11 1.905,2.695; 12 0.635,2.695; 13 -0.635,2.695; 14 -1.905,2.695; 15 -3.175,2.695; 16 -4.445,2.695
SOIC127P599X175-8N = smd 1.967 x 0.599: 1 -2.469,1.905; 2 -2.469,0.635; 3 -2.469,-0.635; 4 -2.469,-1.905; 5 2.469,-1.905; 6 2.469,-0.635; 7 2.469,0.635; 8 2.469,1.905
SOT95P247X112-3N = smd 1.164 x 0.589: 1 -1.097,0.95; 2 -1.097,-0.95; 3 1.097,0
SOT95P280X110-6N = smd 1.259 x 0.609: 1 -1.228,0.95; 2 -1.228,0; 3 -1.228,-0.95; 4 1.228,-0.95; 5 1.228,0; 6 1.228,0.95
ICSP_HEADER = drill 1.016 octagon: 1 -2.54,-1.27; 2 -2.54,1.27; 3 0,-1.27; 4 0,1.27; 5 2.54,-1.27; 6 2.54,1.27
1X04 = drill 1.016 long: 1 -3.81,0; 2 -1.27,0; 3 1.27,0; 4 3.81,0
U-USBBR04P-F000 = drill 0.92 pad 1.676: 1 1.25,6.35; 2 -1.25,6.35; 3 -1.25,4.35; 4 1.25,4.35 | drill 2.3 pad 3.81: 5 -6.1,1.85; 6 6.1,1.85
W237-4 = drill 1.194 long: 1 -7.5,-1.27; 2 -2.5,-1.27; 3 2.5,-1.27; 4 7.5,-1.27
SOP65P640X120-29T275X620N = smd 1.559 x 0.404: 1 -2.878,4.225; 2 -2.878,3.575; 3 -2.878,2.925; 4 -2.878,2.275; 5 -2.878,1.625; 6 -2.878,0.975; 7 -2.878,0.325; 8 -2.878,-0.325; 9 -2.878,-0.975; 10 -2.878,-1.625; 11 -2.878,-2.275; 12 -2.878,-2.925; 13 -2.878,-3.575; 14 -2.878,-4.225; 15 2.878,-4.225; 16 2.878,-3.575; 17 2.878,-2.925; 18 2.878,-2.275; 19 2.878,-1.625; 20 2.878,-0.975; 21 2.878,-0.325; 22 2.878,0.325; 23 2.878,0.975; 24 2.878,1.625; 25 2.878,2.275; 26 2.878,2.925; 27 2.878,3.575; 28 2.878,4.225 | smd 2.75 x 6.2: 29 0,0

### Placement (x,y rotation side)
0-10V_OUT  46.61,3.81 0 top
0-10VOUT  55.88,4.45 0 top
C1  8.51,54.23 90 top
C2  37.59,44.32 270 top
C3  24,49.02 0 top
C4  19.05,43.18 180 top
C5  19.05,40.64 180 top
C6  18.16,31.11 0 top
C7  18.16,27.3 0 top
C8  37.85,30.1 270 top
C9  30.1,65.15 90 top
C10  40.89,65.15 90 top
C11  25.91,65.79 270 top
C12  45.09,65.79 90 top
C13  44.07,18.03 180 top
C14  57.28,16.13 270 top
C15  51.69,16.13 270 top
C16  63.25,22.99 90 top
C17  64.77,17.65 0 top
C18  65.28,22.99 90 top
C19  67.31,22.99 90 top
C20  64.77,15.62 0 top
C21  64.77,13.72 0 top
C22  65.53,45.85 90 top
C23  65.28,40.77 0 top
C24  63.5,45.85 90 top
C25  67.56,45.85 90 top
C26  65.28,38.73 0 top
C27  65.28,36.83 0 top
C28  63.37,68.83 90 top
C29  65.28,63.75 0 top
C30  65.41,68.83 90 top
C31  67.44,68.83 90 top
C32  65.28,61.72 0 top
C33  65.28,59.82 0 top
C34  63.37,91.57 90 top
C35  65.02,86.61 0 top
C36  65.41,91.57 90 top
C37  67.44,91.57 90 top
C38  65.02,84.58 0 top
C39  65.02,82.55 0 top
CN1  -3.81,72.39 270 top
COOL  19.18,3.81 0 top
D1  37.59,76.45 180 top
F2  27.94,83.82 0 top
FDN340P  5.08,54.61 270 top
IC1  30.48,29.97 0 top
IC2  12.7,53.34 0 top
IFX27001TF  35.56,66.04 270 top
MOT_X  85.09,16.51 270 top
MOT_Y1  85.09,38.1 270 top
MOT_Y2  85.09,59.69 270 top
MOT_Z  85.09,81.28 270 top
MS1  68.45,11.18 90 top
MS2  70.99,11.18 90 top
PROBE  10.03,3.81 0 top
PWR  24.13,56.13 90 top
Q1  24.13,41.91 270 top
Q2  22.1,29.21 270 top
R1  27.94,56.13 180 top
R2  39.62,44.32 270 top
R3  11.68,61.98 90 top
R4  11.68,58.67 90 top
R5  47.62,18.03 180 top
R6  44.2,14.22 0 top
R7  47.62,14.22 0 top
R8  75.69,11.05 180 top
R9  75.82,33.91 180 top
R10  75.82,57.02 180 top
R11  75.69,79.76 180 top
SJ1  27.94,77.47 0 top
SJ2  54.61,12.7 180 top
SPIN_DIR  28.32,3.81 0 top
SPIN_E  37.47,3.81 0 top
SPREAD_X  63.88,8.64 90 top
SPREAD_Y  63.88,31.62 90 top
SPREAD_Y2  63.88,54.99 90 top
SPREAD_Z  64.01,77.72 90 top
U$1  31.75,45.72 270 top
U$2  5.08,59.69 180 top
U$3  38.1,16.13 180 top
U$4  54.48,16 90 top
U$5  53.34,42.16 180 top
U$6  43.18,29.21 90 top
UART_X  73.28,7.24 0 top
UART_Y1  73.53,30.1 0 top
UART_Y2  73.28,54.1 0 top
UART_Z  73.66,76.83 0 top
USB  5.08,40.64 270 top
VIN  5.08,82.55 270 top
X  93.34,16.64 90 top
X_DRV  72.77,18.54 0 top
Y1  93.34,38.23 90 top
Y1_MS1  68.58,34.04 90 top
Y1_MS2  71.12,34.04 90 top
Y2  93.34,59.94 90 top
Y2_MS1  68.58,57.4 90 top
Y2_MS2  70.99,57.4 90 top
Y_DRV1  72.9,41.4 0 top
Y_DRV2  72.77,64.39 0 top
Z  93.34,81.53 90 top
Z_DRV  72.77,87.25 0 top
Z_MS1  68.71,80.39 90 top
Z_MS2  71.12,80.39 90 top

### Tracks (layer width: path | path; a pad name or v marks a point on that pad's centre or on a via)
+3V3
  Top 0.508: IC2.5 10.16,56.23 | 10.16,56.23 10.16,57.78 8.89,59.05 U$2.2 | C1.2 9.66,56.23 10.16,56.23
+5V  (via drill 0.35, 0.4, 0.75)
  Top 0.305: U$1.16 34.57,50.04 | 13.65,50.86 13.59,50.8 | IC1.4 27.54,30.37 27.94,29.97 27.94,29.21 | 27.94,29.21 27.5,28.77 IC1.6 | 27.94,29.21 29.18,27.97 IC1.18 36.1,27.97 v36.32,28.19 | U$5.5 v50.8,42.16
  Top 0.406: X_DRV.19 76.94,16.92 77.98,15.88 77.98,9.14 78.99,8.13 78.99,6.1 78.18,5.28 70.41,5.28 69.47,6.22 UART_X.1 | UART_X.1 68.33,6.1 SPREAD_X.1 | MS1.1 69.47,9.4 UART_X.1 | SPREAD_Y.1 68.71,29.08 UART_Y1.1 | Y1_MS2.1 Y1_MS1.1 69.72,32.13 UART_Y1.1 | Y_DRV1.19 77.19,39.78 77.85,39.12 77.85,32.64 78.87,31.62 78.87,28.57 78.23,27.94 70.87,27.94 69.72,29.08 UART_Y1.1 | SPREAD_Z.1 68.2,75.18 UART_Z.1 | Z_DRV.19 76.94,85.62 77.85,84.71 77.85,80.77 79.12,79.5 79.12,75.31 78.36,74.55 71.12,74.55 69.85,75.82 UART_Z.1 | Z_MS2.1 Z_MS1.1 69.85,78.49 UART_Z.1 | SPREAD_Y2.1 68.96,52.45 69.47,52.96 | 69.47,52.96 69.6,53.09 69.6,52.45 70.99,51.05 77.85,51.05 78.87,52.07 78.87,55.24 77.85,56.26 77.85,61.98 77.06,62.76 Y_DRV2.19 | 69.47,52.96 UART_Y2.1 69.47,55.75 Y2_MS1.1 Y2_MS2.1 | v55.5,28.96 56.52,29.97 v58.55,29.97
  Top 0.508: IC2.1 11.75,51.12 11.43,50.8 | 11.43,50.8 4.19,50.8 2.54,52.45 2.54,54.04 FDN340P.2 | IC2.3 13.65,50.86 | 13.59,50.8 11.43,50.8 | MS1.1 MS2.1
  Top 0.61: FDN340P.2 2.61,57.15 U$2.8 | C12.+ 41.95,63.25 C10.1 40.12,63.52 IFX27001TF.3 35.69,63.4 | U$1.16 37.59,50.16 39.62,48.13 R2.1 v45.72,45.17 46.01,45.17 46.61,44.58 v46.61,35.43 | SPREAD_Y2.1 58.93,52.45 v58.55,52.07 | SPREAD_Y.1 59.69,29.08 58.8,29.97 v58.55,29.97 | IC2.3 17.81,52.04 20.83,49.02 C3.1 23.15,49.82 25.4,52.07 31.75,52.07 | U$1.16 34.45,50.65 33.02,52.07 31.75,52.07 | U$1.16 34.45,51.08 | v58.42,74.55 59.05,75.18 SPREAD_Z.1 | R1.1 31.75,53.17 31.75,52.07
  Top 0.813: 34.45,51.08 35.69,52.32 35.69,63.4
  Bottom 0.305: v36.32,28.19 37.85,26.67 U$6.2 43.18,27.94 46.61,27.94 | v50.8,42.16 50.8,43.18 48.81,45.17 v45.72,45.17
  Bottom 0.406: 46.61,27.94 54.48,27.94 v55.5,28.96 | 33.15,7.24 33.15,17.65 41.91,26.42 U$6.2 | SPIN_E.3 40.01,7.24 33.15,7.24 | COOL.3 21.72,5.46 23.5,7.24 33.15,7.24
  Bottom 0.61: SPREAD_X.1 63.01,6.1 61.61,7.49 61.61,11.52 58.55,14.58 v58.55,29.97 v58.55,52.07 58.55,74.42 v58.42,74.55 | 46.61,27.94 v46.61,35.43
+12V  (via drill 0.35)
  Top 0.305: 35.7,14.15 U$3.8
  Top 0.406: SJ2.2 53.53,13.02 U$4.1
  Top 0.508: C15.2 51.69,14.86 49.78,12.95 v49.78,12.7 | v37.59,12.7 37.16,12.7 35.7,14.15
  Top 0.61: U$4.1 52.77,14.9 52.4,15.28 C15.2
  Bottom 0.508: v49.78,12.7 v37.59,12.7
COOL_ENABLE  (via drill 0.35)
  Top 0.305: v34.04,36.2 33.4,36.2 32.48,35.27 IC1.26
  Bottom 0.305: COOL.2 19.18,15.37 28.19,24.38 28.19,27.18 34.29,33.27 34.29,35.94 v34.04,36.2
GND  (via drill 0.4)
  Top 0.254: 72.9,42.42 73.66,43.18
  Top 0.305: C1.1 12.15,53.38 12.7,52.83 | 12.7,52.83 IC2.2 | R4.1 12.7,56.81 12.7,52.83 | IC1.5 25.29,29.57 25.02,29.84 25.02,30.99 25.2,31.17 IC1.3 28.52,31.17 29.32,30.37 IC1.21 36.21,30.37 36.79,30.95 C8.1 41.11,30.95 U$6.6 | C19.2 C18.2 C16.2 | 63.12,11.94 SPREAD_X.3 61.47,13.59 61.47,17.14 63.84,19.52 | C39.1 61.98,82.55 | X_DRV.6 63.84,19.52 | C14.1 57.28,17.36 59.43,19.52 63.84,19.52
  Top 0.406: X_DRV.27 X_DRV.2 68.94,22.12 68.58,22.48 68.58,23.62 68.36,23.84 C19.2 | 63.12,11.94 63.12,12.91 C21.1 | Y_DRV1.27 Y_DRV1.2 69.07,44.98 68.71,45.34 68.71,46.32 68.33,46.7 C25.2 C22.2 C24.2 | C27.1 62.99,36.83 62.23,37.59 62.23,41.02 63.59,42.38 Y_DRV1.6 | C34.2 C36.2 C37.2 68.11,92.42 68.45,92.08 68.45,91.3 68.93,90.82 Z_DRV.2 Z_DRV.27 | Z_DRV.6 63.2,88.22 61.98,87 61.98,82.55 64.01,80.52 SPREAD_Z.3 | Y_DRV2.27 Y_DRV2.2 68.94,67.96 68.58,68.33 68.58,69.22 68.11,69.68 C31.2 C30.2 C28.2 | Y_DRV2.6 63.37,65.36 62.33,64.32 62.33,60.98 63.5,59.82 C33.1 64.43,58.08 SPREAD_Y2.3 | U$3.4 39.68,18.03 38.99,17.34 38.99,10.16 0-10V_OUT.1
  Top 0.508: C13.2 U$3.4
  Top 0.61: C12.- 43.22,68.33 C10.2 40.89,67.57 IFX27001TF.1 | C9.1 29.04,63.25 C11.- | C5.2 18.2,41.91 C4.2 | C7.1 C6.1 | U$2.6 U$2.5 | U$2.5 U$2.4 | U$2.5 2.61,71.46 CN1.GND | R7.2 49.53,15.28 49.53,15.49 51.02,16.98 C15.1 51.81,17.1 U$4.3 57.16,17.1 C14.1 | U$1.1 27.69,50.16 v27.3,49.78
  Top 1.27: CN1.GND 3.54,79.78 VIN.2
  other vias: 72.14,38.86 73.66,38.86 72.9,39.75 73.66,40.64 72.14,40.64 72.14,42.16 73.66,42.16 72.9,41.4 72.9,43.05 72.14,43.94 73.66,43.94 73.53,61.85 72.01,61.85 72.77,62.74 73.53,63.63 72.01,63.63 72.77,64.39 73.53,65.15 72.01,65.15 72.77,66.04 72.01,66.93 73.53,66.93 73.53,84.71 72.01,84.71 72.77,85.6 73.53,86.49 72.01,86.49 72.77,87.25 73.53,88.01 72.01,88.01 72.77,88.9 72.01,89.79 73.53,89.79 72.77,20.19 72.01,21.08 73.53,21.08 72.01,19.3 73.53,19.3 72.77,18.54 72.01,17.78 73.53,17.78 72.77,16.89 72.01,16 73.53,16
  pour Top (isolate 0.254): 0,96.14 0,1.27 1.27,0 96.52,0 98.04,1.52 98.04,96.01 96.01,98.04 1.91,98.04
  pour Bottom (isolate 0.254): 0.25,96.52 0,0 97.79,0 97.79,95.89 95.63,98.04 1.78,98.04
MISO
  Top 0.254: 33.28,25.3 IC1.16
  Top 0.305: U$6.1 44.07,26.67 42.7,25.3 33.28,25.3
N$1
  Top 0.508: U$1.4 28.17,46.35 25.5,49.02 C3.2
N$2
  Top 0.305: C2.1 36.41,46.35 U$1.13
N$3
  Top 0.406: Q1.2 26.09,40.06 27.3,41.27 U$1.8
  Top 0.508: C5.1 20.48,40.06 Q1.2
N$4
  Top 0.406: Q1.1 26.09,43.76 27.3,42.55 U$1.7
  Top 0.508: C4.1 20.48,43.76 Q1.1
N$5
  Top 0.406: U$1.6 27.69,43.81 26.16,45.34 16.38,45.34 12.93,41.89 USB.2
N$6
  Top 0.305: PWR.A R1.2
N$7
  Top 0.305: 22.04,31.11 Q2.1 22.91,31.06 24.26,29.72 24.26,28.83 25.11,27.97 IC1.7
  Top 0.61: C6.2 22.04,31.11
N$8
  Top 0.305: IC1.8 22.29,27.17 Q2.2 22.04,27.3
  Top 0.61: C7.2 22.04,27.3
N$9
  Top 0.305: IC1.20 36.34,29.57 36.7,29.21 37.81,29.21 C8.2
N$11
  Top 0.406: U$1.5 27.81,45.09 26.54,46.35 12.62,46.35 9.43,43.16 USB.3
N$12
  Top 0.305: 6.1,55.63 FDN340P.1
  Top 0.508: U$2.1 7.55,57.08 6.1,55.63
N$15
  Top 1.27: 20.32,83.78 F2.1
  Top 1.524: VIN.1 5.08,86.32 17.78,86.32 20.32,83.78 9.79,73.25 CN1.PWR | SJ1.1 26.67,80.01 22.86,83.82 F2.1
N$16
  Top 0.508: R4.2 11.68,60.33 | 11.68,60.33 R3.1 | U$2.3 11.68,60.33
N$17
  Top 1.27: F2.2 35.59,83.79
  Top 1.524: SJ1.2 29.21,80.01 33.02,83.82 F2.2 | 35.59,83.79 D1.A
N$18
  Top 0.305: C17.2 66.18,18.22 X_DRV.8
N$19
  Top 0.508: R5.2 C13.1 44.92,17.36 44.32,16.76 U$3.3
N$20
  Top 0.508: U$3.2 44.45,15.49 45.05,14.9 R6.2 R7.1
N$21
  Top 0.508: 0-10V_OUT.2 47.88,6.22 48.13,6.48 56.6,6.48 58.38,4.7 0-10VOUT.2 | R6.1 U$3.1
  Top 0.61: 0-10V_OUT.2 47.88,9.53 43.35,14.06 R6.1
N$22
  Top 0.305: 64.14,17.87 64.14,18.29 64.71,18.87 X_DRV.7
  Top 0.406: C17.1 64.14,17.87
N$23
  Top 0.406: X_DRV.4 61.61,20.82 60.96,21.46 60.96,24.51 61.47,25.02 78.87,25.02 83.57,20.32 MOT_X.1
  Top 0.61: MOT_X.1 87.88,20.32 91.7,24.14 X.4
N$24
  Top 0.406: X_DRV.1 69.89,23.28 70.36,23.75 78.99,23.75 81.03,21.72 81.03,18.03 81.28,17.78 MOT_X.2
  Top 0.61: MOT_X.2 89.7,17.78 91.06,19.14 X.3
N$25
  Top 0.406: X_DRV.28 78.71,22.77 80.09,21.39 80.09,17.45 82.3,15.24 MOT_X.3
  Top 0.61: MOT_X.3 89.83,15.24 90.93,14.14 X.2
N$26
  Top 0.406: X_DRV.25 77.61,20.82 79.12,19.3 79.12,16.89 83.31,12.7 MOT_X.4
  Top 0.61: MOT_X.4 88.01,12.7 91.57,9.14 X.1
N$27  (via drill 0.45)
  Top 0.305: X_DRV.10 68.15,16.92 v67.84,16.61
  Bottom 0.305: v67.84,16.61 66.8,15.57 66.8,10.03 65.41,8.64 SPREAD_X.2
N$28
  Top 0.305: X_DRV.9 67.1,17.57 66.51,16.98 66.51,16.26 65.87,15.62 C20.2
N$29
  Top 0.305: C21.2 67.14,13.72 67.78,14.35 67.78,15.2 68.84,16.27 X_DRV.11
N$30
  Top 0.305: X_DRV.18 76.57,16.27 77.09,15.75 77.09,11.6 R8.1 76.54,10.16 74.55,8.17 UART_X.3
N$31
  Top 0.305: MS1.2 68.45,15.15 68.92,15.62 X_DRV.12
N$32
  Top 0.305: X_DRV.14 70.99,13.22 MS2.2
N$33
  Top 0.305: R8.2 74.72,11.05 72.01,8.34 UART_X.2
N$34
  Top 0.305: C23.2 66.44,41.08 Y_DRV1.8
N$35
  Top 0.305: C23.1 64.52,40.85 64.52,41.4 64.84,41.73 Y_DRV1.7
N$36
  Top 0.406: Y_DRV1.4 61.48,43.68 60.71,44.45 60.71,47.24 61.34,47.88 78.11,47.88 84.07,41.91 MOT_Y1.1
  Top 0.61: MOT_Y1.1 88.01,41.91 91.83,45.73 Y1.4
N$37
  Top 0.406: Y_DRV1.1 70.02,46.01 70.62,46.61 78.18,46.61 80.64,44.15 80.64,40.39 81.66,39.37 MOT_Y1.2
  Top 0.61: MOT_Y1.2 89.53,39.37 90.89,40.73 Y1.3
N$38
  Top 0.406: Y_DRV1.28 78.2,45.63 79.76,44.07 79.76,39.5 82.42,36.83 MOT_Y1.3
  Top 0.61: MOT_Y1.3 89.53,36.83 90.64,35.73 Y1.2
N$39
  Top 0.406: Y_DRV1.25 77.25,43.68 78.87,42.05 78.87,38.86 83.44,34.29 MOT_Y1.4
  Top 0.61: MOT_Y1.4 88.01,34.29 91.57,30.73 Y1.1
N$40
  Top 0.305: C26.2 66.55,38.73 67.06,39.24 67.06,39.75 67.73,40.43 Y_DRV1.9
N$41  (via drill 0.45)
  Top 0.305: Y_DRV1.10 69.99,39.75 68.36,39.75 v68.03,39.41
  Bottom 0.305: v68.03,39.41 66.55,37.93 66.55,32.51 65.66,31.62 SPREAD_Y.2
N$42
  Top 0.305: C27.2 67.44,36.83 67.82,37.21 67.82,37.98 68.96,39.13 Y_DRV1.11
N$43
  Top 0.305: Y1_MS1.2 68.58,37.97 69.09,38.48 Y_DRV1.12
N$44
  Top 0.305: Y1_MS2.2 71.12,36.45 70.39,37.18 Y_DRV1.14
N$45
  Top 0.305: UART_Y1.3 74.8,31.37 76.67,33.23 R9.1 76.67,34.51 77.09,34.92 77.09,38.73 76.7,39.13 Y_DRV1.18
N$46
  Top 0.305: UART_Y1.2 72.26,31.88 74.3,33.91 R9.2
N$47
  Top 0.305: C29.2 67.18,63.75 67.49,64.06 Y_DRV2.8
N$48
  Top 0.305: 64.64,63.97 64.64,64.39 64.97,64.71 Y_DRV2.7
  Top 0.406: C29.1 64.64,63.97
N$49
  Top 0.406: Y_DRV2.4 61.73,66.66 61.09,67.31 61.09,69.98 62.1,70.99 69.85,70.99 70.48,70.36 78.11,70.36 84.96,63.5 MOT_Y2.1
  Top 0.61: MOT_Y2.1 87.76,63.5 91.7,67.44 Y2.4
N$50
  Top 0.406: Y_DRV2.1 69.89,68.88 70.61,69.6 77.85,69.6 80.14,67.31 80.14,62.61 81.79,60.96 MOT_Y2.2
  Top 0.61: MOT_Y2.2 89.7,60.96 91.19,62.44 Y2.3
N$51
  Top 0.406: Y_DRV2.28 77.82,68.61 79.38,67.06 79.38,60.07 81.03,58.42 MOT_Y2.3
  Top 0.61: MOT_Y2.3 89.58,58.42 90.55,57.44 Y2.2
N$52
  Top 0.406: Y_DRV2.25 77.72,66.66 78.61,65.77 78.61,57.78 80.52,55.88 MOT_Y2.4
  Top 0.61: MOT_Y2.4 87.76,55.88 91.19,52.44 Y2.1
N$53
  Top 0.305: C32.2 66.13,61.81 67.73,63.41 Y_DRV2.9
N$54  (via drill 0.45)
  Top 0.305: Y_DRV2.10 68.22,62.76 67.88,62.42 v67.91,62.4
  Bottom 0.305: v67.91,62.4 66.93,61.42 66.93,56.13 65.79,54.99 SPREAD_Y2.2
N$55
  Top 0.305: C33.2 67.31,59.82 67.82,60.33 67.82,61.09 68.84,62.11 Y_DRV2.11
N$56
  Top 0.305: Y_DRV2.12 68.96,61.47 68.58,61.09 Y2_MS1.2
N$57
  Top 0.305: Y2_MS2.2 70.99,59.82 70.65,60.16 Y_DRV2.14
N$58
  Top 0.305: Y_DRV2.18 76.57,62.11 77.22,61.47 77.22,58.29 76.67,57.75 R10.1 76.67,56.6 74.55,54.48 UART_Y2.3
N$59
  Top 0.305: R10.2 74.08,57.02 72.77,55.71 72.77,54.86 UART_Y2.2
N$60
  Top 0.305: Z_DRV.8 66.1,86.92 65.87,86.7 C35.2
N$61
  Top 0.305: C35.1 64.17,86.91 64.84,87.57 Z_DRV.7
N$62
  Top 0.406: Z_DRV.4 61.73,89.52 61.21,90.04 61.21,92.58 62.36,93.73 77.85,93.73 85.09,86.49 MOT_Z.1
  Top 0.61: MOT_Z.1 88.27,85.09 92.21,89.03 Z.4
N$63
  Top 0.406: Z_DRV.1 69.89,91.99 70.74,92.84 77.6,92.84 80.14,90.3 80.14,85.22 82.8,82.55 MOT_Z.2
  Top 0.61: MOT_Z.2 89.66,82.55 91.15,84.03 Z.3
N$64
  Top 0.406: Z_DRV.28 77.75,91.47 79.38,89.85 79.38,83.44 82.8,80.01 MOT_Z.3
  Top 0.61: MOT_Z.3 89.66,80.01 90.64,79.03 Z.2
N$65
  Top 0.406: Z_DRV.25 77.72,89.52 78.61,88.63 78.61,81.15 82.3,77.47 MOT_Z.4
  Top 0.61: MOT_Z.4 87.76,77.47 91.19,74.03 Z.1
N$66
  Top 0.305: C38.2 66.42,84.58 66.8,84.96 66.8,86.11 66.97,86.27 Z_DRV.9
N$67  (via drill 0.45)
  Top 0.305: Z_DRV.10 67.98,85.62 v67.69,85.34
  Bottom 0.305: v67.69,85.34 66.55,84.19 66.55,78.49 65.79,77.72 SPREAD_Z.2
N$68
  Top 0.305: C39.2 66.8,82.55 68.07,83.82 68.07,84.21 68.83,84.97 Z_DRV.11
N$69
  Top 0.305: Z_MS1.2 68.71,84.07 68.96,84.32 Z_DRV.12
N$70
  Top 0.305: Z_DRV.14 71.12,81.8 Z_MS2.2
N$71
  Top 0.305: Z_DRV.18 76.57,84.97 77.22,84.33 77.22,81.03 76.54,80.35 R11.1 76.54,79.08 74.93,77.47 UART_Z.3
N$72
  Top 0.305: R11.2 74.8,79.76 72.39,77.34 UART_Z.2
N$111
  cutout Top: 1.27,95.25 1.27,93.6 3.94,93.6 4.57,93.6 4.57,95.76 4.57,96.52 3.17,96.52 1.27,96.52
N$112
  cutout Top: 1.27,3.81 1.27,1.4 4.06,1.4 4.57,1.4 4.57,3.68 4.57,3.81
N$113
  cutout Top: 93.47,4.32 93.47,1.4 95.89,1.4 96.52,1.4 96.52,4.19 96.52,4.32
N$114
  cutout Top: 93.98,95.25 93.98,93.73 96.39,93.73 96.39,96.27 93.98,96.27
PROBE  (via drill 0.35)
  Top 0.305: v30.99,36.32 30.99,35.18 30.86,35.05 30.86,34.28 IC1.28
  Bottom 0.305: 11.3,5.08 PROBE.2 11.05,4.06 11.05,8.38 27.43,24.77 27.43,27.3 30.99,30.86 v30.99,36.32
RESET
  Top 0.305: IC1.29 30.08,36.8 32.68,39.41 34.8,39.41 37.59,42.2 C2.2 R2.2
  Top 0.406: U$6.5 44.45,34.29 39.62,39.12 R2.2
RX
  Top 0.305: U$1.3 29.84,47.62 31.62,45.85 31.62,39.95 28.48,36.8 IC1.31
SPINDLE_DIR  (via drill 0.35)
  Top 0.305: U$6.3 43.18,27.94 40.62,27.94 39.85,27.17 IC1.17 34.77,26.44 v35.05,26.16 | v31.62,18.03 31.62,18.01 29.59,15.98 SPIN_DIR.2
  Bottom 0.305: v31.62,18.03 35.18,21.59 35.18,26.04 v35.05,26.16
SPINDLE_PWM  (via drill 0.35)
  Top 0.305: U$6.4 43.18,30.48 44.96,30.48 45.97,29.46 45.97,26.16 | IC1.15 32.48,24.92 32.77,24.64 44.96,24.64 45.97,25.65 45.97,26.16 | 45.97,26.16 v46.74,26.16 | v50.04,18.41 49.15,18.41 48.77,18.03 R5.1
  Top 0.406: SPIN_E.2 37.47,7.75 33.15,12.06 33.15,18.03 34.54,19.43 47.84,19.43 48.48,18.8 R5.1
  Bottom 0.305: v46.74,26.16 50.04,22.86 v50.04,18.41
STEPPERS_ENABLE  (via drill 0.35)
  Top 0.406: IC1.12 30.08,24.15 34.04,20.19 v57.28,20.19 57.3,20.17 X_DRV.5 | Z_DRV.5 60.43,88.87 v58.42,86.87 | v57.28,64.26 58.29,64.26 60.05,66.01 Y_DRV2.5 | v57.28,44.45 58.55,44.45 59.97,43.03 Y_DRV1.5
  Bottom 0.406: v57.28,20.19 v57.28,44.45 v57.28,64.26 57.28,85.72 v58.42,86.87
TX
  Top 0.305: U$1.2 30.35,48.9 32.26,46.99 32.26,39.78 29.28,36.8 IC1.30
USBVCC  (via drill 0.55)
  Top 0.61: v5.08,52.07 FDN340P.3
  Bottom 0.61: USB.1 11.43,38.1 10.67,37.34 8.64,37.34 3.56,42.42 3.56,50.55 v5.08,52.07
VIN  (via drill 0.35, 0.4, 0.45)  (4 unrouted)
  Top 0.305: C38.1 62.99,84.58 v62.87,84.45 | C32.1 v63.25,61.72 | C26.1 63.5,38.73 v63.25,38.99 | 62.27,90.72 v62.1,90.55 | Z_DRV.26 77.09,90.17 v77.34,90.42 | Y_DRV2.26 77.09,67.31 v77.34,67.56 | Y_DRV1.26 77.86,44.33 v77.98,44.45 | C20.1 v62.48,15.62 | X_DRV.26 77.47,21.47 v77.85,21.84
  Top 0.406: C19.1 67.78,22.14 68.45,21.46 X_DRV.3 | C25.1 67.91,45 68.58,44.32 Y_DRV1.3 | C37.1 67.78,90.72 68.33,90.17 Z_DRV.3 | Y_DRV2.3 68.11,67.31 C31.1 | SJ2.1 55.43,12.76 U$4.2
  Top 0.508: IFX27001TF.2 30.1,67.44 C9.2
  Top 0.61: C9.2 27.77,68.33 C11.+ 17.18,68.33 R3.2 | D1.C 39.59,75.03 38.23,73.67 35.06,73.67 33.28,71.9 IFX27001TF.2 | U$4.2 56.32,14.9 56.7,15.28 C14.2 57.78,15.28 60.33,17.82 v60.33,18.03
  Top 0.813: C19.1 C18.1 C16.1 62.32,22.14 v62.1,22.35 | C25.1 C22.1 C24.1 62.19,45 v61.85,45.34 | C37.1 C36.1 C34.1 62.27,90.72 | C31.1 C30.1 C28.1 62.32,67.98 v61.98,68.33
  Top 1.778: D1.C 44.7,76.45 54.61,86.36 | 54.61,86.36 v58.42,90.17 | v59.69,90.17 58.8,90.17 | 54.61,86.36 56.39,84.58 59.05,84.58 60.3,83.34 60.3,77.58
  Bottom 0.813: 60.33,69.98 v61.98,68.33 76.58,68.33 v77.34,67.56 | v62.87,84.45 60.33,81.92 | v63.25,61.72 60.33,64.64 | 60.33,46.86 v61.85,45.34 61.98,45.47 76.96,45.47 v77.98,44.45 | v63.25,38.99 60.33,41.91 | v62.1,90.55 60.33,88.77 | v77.34,90.42 76.2,91.57 63.12,91.57 v62.1,90.55 | 60.33,24.13 v62.1,22.35 62.74,22.98 77.21,22.98 77.85,22.35 v77.85,21.84 | 61.72,90.17 v62.1,90.55
  Bottom 1.778: v62.48,15.62 60.33,17.78 v60.33,18.03 60.33,24.13 60.33,41.91 60.33,46.86 60.33,64.64 60.33,69.98 60.33,81.92 60.33,88.77 60.33,89.53 v59.69,90.17 v58.42,90.17
  other vias: 60.33,77.6 60.33,78.87 60.33,80.01 60.33,81.15
X_DIAG  (via drill 0.35)
  Top 0.305: X_DRV.15 76.07,13.89 v76.07,13.08 | v56.39,37.08 56.39,40.13 55.31,41.21 U$5.1
  Bottom 0.305: v76.07,13.08 78.99,10.16 78.99,6.1 77.22,4.32 62.48,4.32 56.39,10.41 v56.39,37.08
X_DIR  (via drill 0.35)
  Top 0.406: X_DRV.23 77.17,19.52 v77.22,19.56 | v62.36,25.91 50.42,25.91 46.35,21.84 v33.78,21.84 | v30.73,21.84 28.45,21.84 27.68,22.61 IC1.9
  Bottom 0.406: v77.22,19.56 80.14,22.48 80.14,24.77 78.99,25.91 v62.36,25.91 | v33.78,21.84 v30.73,21.84
X_PULSE  (via drill 0.35)
  Top 0.406: X_DRV.20 77.26,17.57 v77.72,18.03 | v63.37,26.8 55.88,26.8 54.23,28.45 54.23,32.51 v49.4,37.34 | IC1.32 26.67,35.27 v26.67,35.56
  Bottom 0.406: v77.72,18.03 81.15,21.46 81.15,25.02 79.38,26.8 v63.37,26.8 | v49.4,37.34 28.45,37.34 v26.67,35.56
XY1Z_DIAG_OR  (via drill 0.35)
  Top 0.305: U$5.4 49.97,43.11 49.4,42.55 v49.4,42.04 | v37.59,38.25 36.7,37.36 36.7,32.51 36.16,31.97 IC1.23
  Bottom 0.305: v49.4,42.04 45.62,38.25 v37.59,38.25
Y1_DIAG  (via drill 0.35)
  Top 0.305: Y_DRV1.15 75.78,36.02 v75.44,35.69 | v61.98,42.11 56.82,42.11 55.82,43.11 U$5.3
  Bottom 0.305: v75.44,35.69 70.23,35.69 69.22,36.7 69.22,39.75 66.8,42.16 62.03,42.16 v61.98,42.11
Y2_DIAG  (via drill 0.35)
  Top 0.305: Y_DRV2.15 75.65,59.23 v75.95,58.93 | v62.23,50.8 v56.13,50.8 | v35.31,34.04 35.31,33.3 IC1.24
  Bottom 0.305: v75.95,58.93 71.37,58.93 67.31,54.86 67.31,52.07 66.04,50.8 v62.23,50.8 | v56.13,50.8 56.01,50.67 56.01,38.23 54.23,36.45 37.08,36.45 35.31,34.67 v35.31,34.04
Y_DIR  (via drill 0.35)
  Top 0.406: Y_DRV2.23 77.26,65.36 v77.72,64.9 | v65.41,48.77 49.4,48.77 48.51,47.88 48.51,25.15 46.23,22.86 v32.64,22.86 | v29.97,22.86 28.83,22.86 28.48,23.21 IC1.10 | Y_DRV1.23 76.88,42.38 v77.22,42.04
  Bottom 0.406: v77.72,64.9 79.76,62.87 79.76,50.67 | 79.76,50.67 77.85,48.77 v65.41,48.77 | v32.64,22.86 v29.97,22.86 | v77.22,42.04 77.6,42.04 79.76,44.2 79.76,50.67
Y_PULSE  (via drill 0.35)
  Top 0.406: Y_DRV2.20 77.56,63.41 v77.72,63.25 | v64.39,49.78 v53.98,49.78 | v24.89,33.66 25.77,32.77 IC1.1 | Y_DRV1.20 77.51,40.43 v77.72,40.64 | v80.77,49.15 80.77,49.53 80.14,50.16 v77.6,50.16
  Bottom 0.406: v77.72,63.25 78.87,62.1 78.87,51.44 v77.6,50.16 77.22,49.78 v64.39,49.78 | v53.98,49.78 39.62,49.78 24.77,34.92 24.77,33.78 v24.89,33.66 | v77.72,40.64 80.77,43.69 v80.77,49.15
Z_DIAG  (via drill 0.35)
  Top 0.305: Z_DRV.15 75.65,82.08 v75.95,81.79 | v52.07,40.01 52.07,41.17 U$5.6
  Bottom 0.305: v75.95,81.79 75.95,88.65 76.45,89.15 77.98,89.15 78.61,89.79 78.61,91.44 77.22,92.84 58.55,92.84 55.24,89.53 55.24,40.39 54.74,39.88 52.2,39.88 v52.07,40.01
Z_DIR  (via drill 0.35)
  Top 0.406: Z_DRV.23 77.38,88.22 v77.6,88.01 | v64.39,72.52 62.48,72.52 47.62,57.66 47.62,25.53 45.85,23.75 v32,23.75 | v29.34,23.88 29.28,23.93 IC1.11
  Bottom 0.406: v77.6,88.01 80.01,85.6 80.01,74.55 77.98,72.52 v64.39,72.52 | v32,23.75 29.46,23.75 v29.34,23.88
Z_PULSE  (via drill 0.35)
  Top 0.406: Z_DRV.20 77.54,86.27 v77.65,86.16 | v63.63,73.41 61.86,73.41 v54.36,66.04 | IC1.2 24.8,31.97 v22.61,34.16
  Bottom 0.406: v77.65,86.16 79.12,84.69 79.12,75.06 77.47,73.41 v63.63,73.41 | v54.36,66.04 v22.61,34.16

### Text on the board
tPlace: INDYSTRY.CC | NIKODEM BARTNIK | INDYCONTROLLER | 04.11.2021
tNames: Up to 24V | 24V | MS1 | MS2 | GND | 5V TX RX GND | MS1 | MS2 | 5V TX RX GND | MS1 | MS2 | 5V TX RX GND | V0.1 | GND | SIG | GND | SIG | GND | SIG | 5V | GND | SIG | GND | SIG | 5V | GND | SIG | 5V TX RX GND